# EasyEDA Pro project stiebel_eltron_bus_extension_pcb.eprj, board 1-PCB_PCB_stiebel_can_sniffer
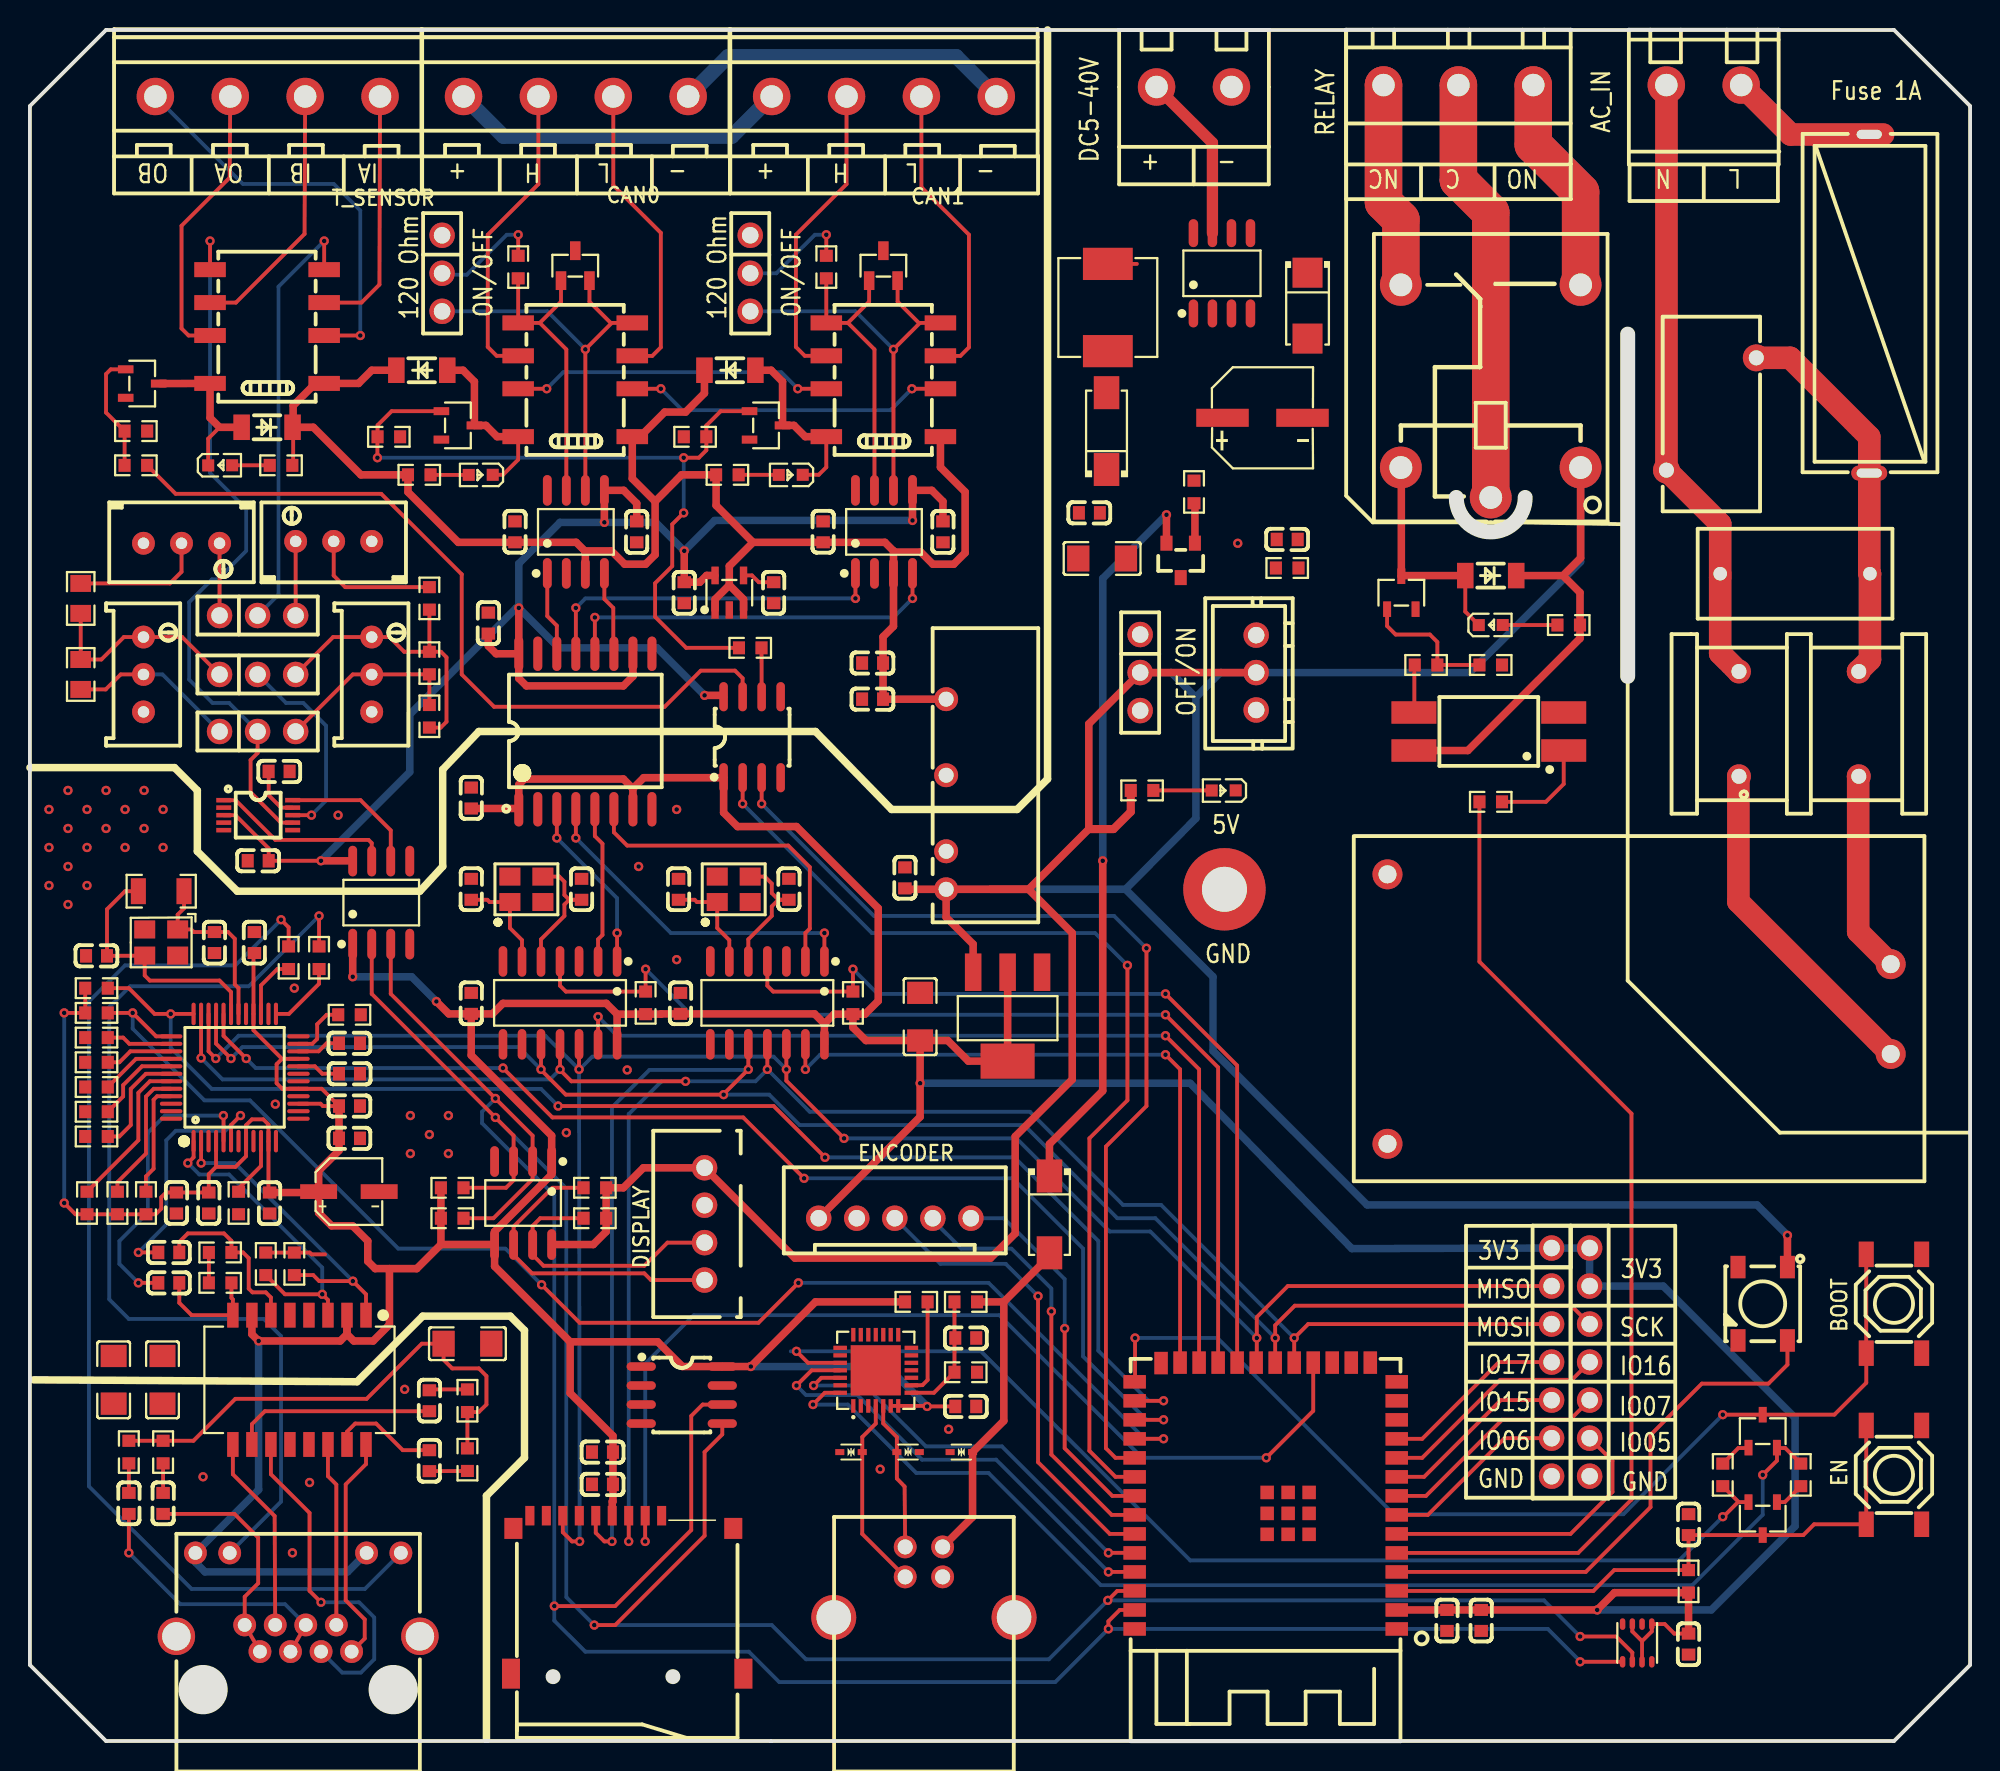
[diagram p1: board, top side]
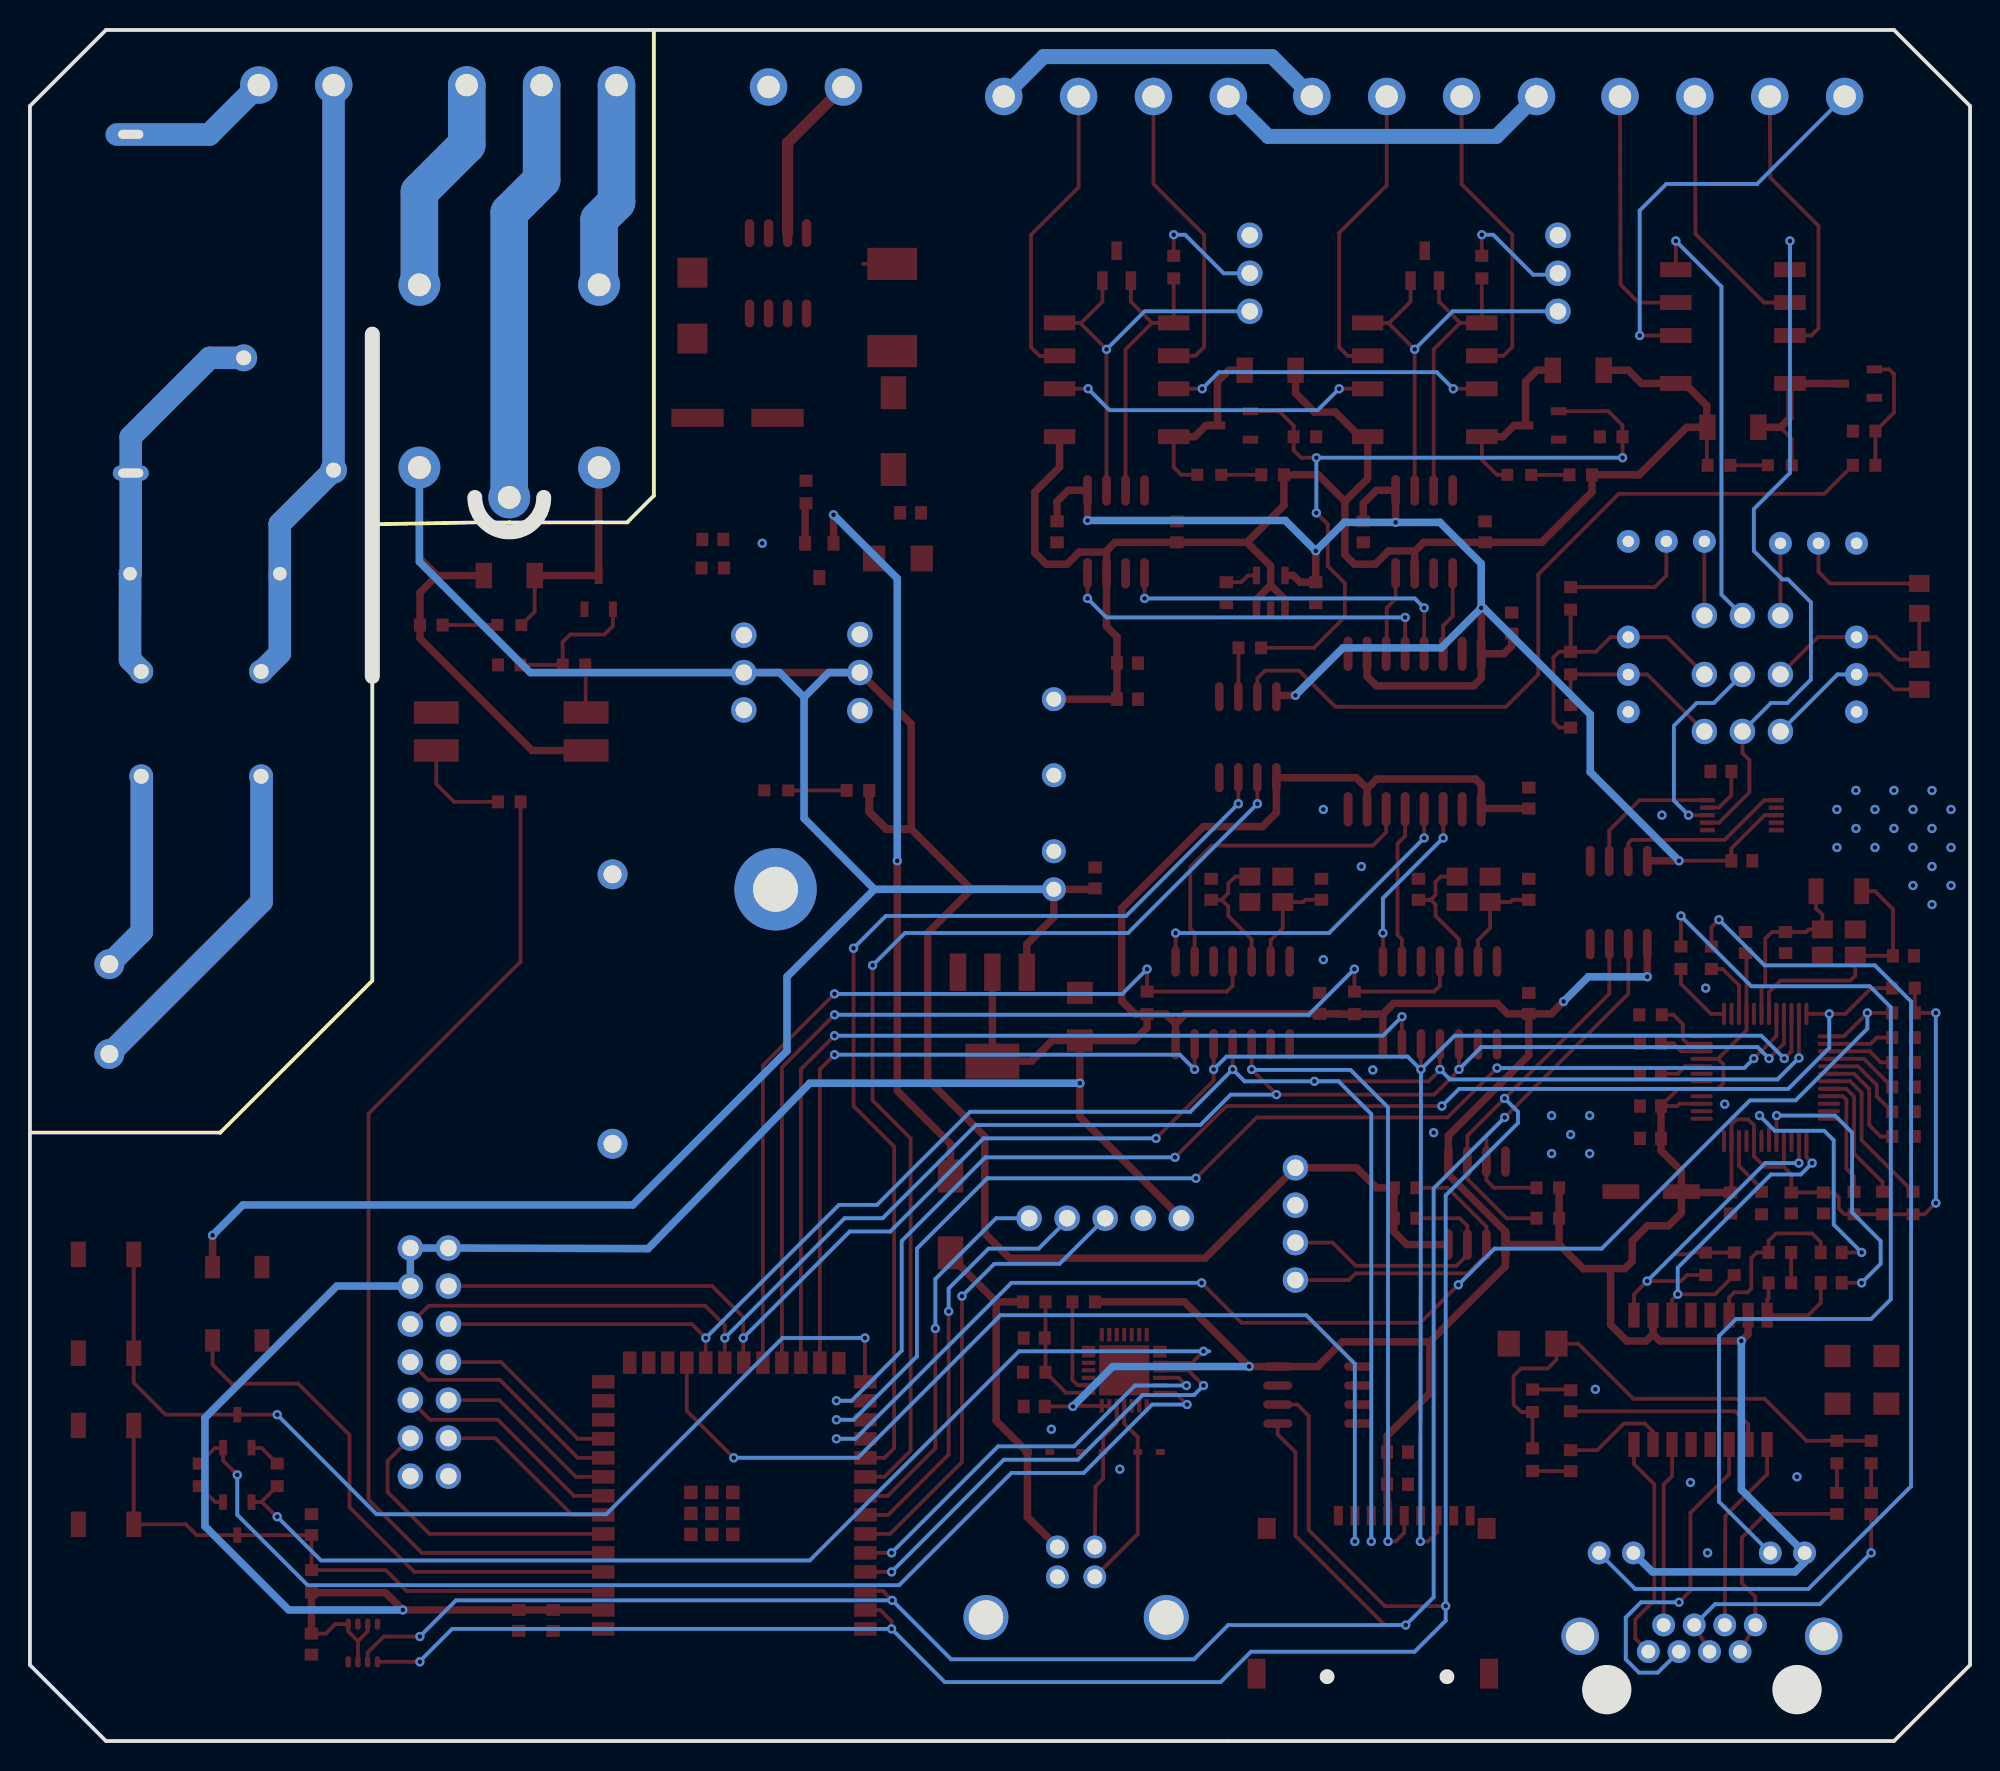
[diagram p2: board, bottom side, seen from below]

Outline 129.54 x 114.3 mm; copper layers: Top Layer, Bottom Layer. Coordinates in mm from the lower left corner of the outline.
Outline path: 99.84,83.07 arc(97.54,80.77) 95.24,83.07 ; 106.68,71.12 106.68,93.98 ; 0,109.22 0,5.08 5.08,0 124.46,0 129.54,5.08 129.54,109.22 124.46,114.3 5.08,114.3 0,109.22
Stack: Top Layer 0.035mm / Dielectric1 1.51mm FR4 er 4.5 / Bottom Layer 0.035mm

## Design rules (mm)
spacing Default (default): track to track 0.152, other pairs 0 to 0.152
track width Default (default): min 0.254, default 0.254, max 25.4
differential pair differentialPair (default): width min 0.127, default 0.254, max 2.54; gap min 0.152, default 0.152
via Default (default): diameter min 0.61, default 0.61, max 100.025; hole min 0.305, default 0.305, max 59.995
net SGND uses gge68040(1)
net HGND uses gge110343(1)
net GND uses gge148324(1)
net LM_5V_8 uses gge107073
net 5V_RAW uses gge107085
net C6_2 uses gge120455
pour e320 uses gge110343
pour e321 uses gge148324
pour e1328 uses gge107073
pour e1329 uses gge107085
pour e1330 uses gge110343(1)
pour e1331 uses gge68040(1)
pour e1332 uses gge120455
pour e1333 uses gge148324(1)

## Placement (name value [footprint] x y rotation side)
BOOT  TS-1187A-B-A-B  [SW-SMD_4P-L5.1-W5.1-P3.70-LS6.5-TL-2]  124.46 29.21 270 top
C1  22pF  [C0603]  29.46 56.9 270 top
C3  10uF  [C0603]  62.48 22.35 180 top
C4  10uF  [C0603]  96.9 8.06 90 top
C5  100nF  [C0603]  94.61 8.06 90 top
C6  22uF  [C1206]  71.59 78.99 0 top
C8  22uF  [C1206]  59.44 48.39 270 top
C9  6.8nF  [C0603]  9.27 32.64 180 top
C10  6.8nF  [C0603]  9.27 30.61 180 top
C11  1uF  [C0603]  62.48 26.92 180 top
C12  22pF  [C0603]  36.83 56.9 270 top
C14  100nF  [CAP-TH_L13.0-W6.0-P10.00-D1.2]  117.86 77.98 0 top
C15  10uF  [C0603]  38.23 19.3 180 top
C16  100nF  [C0603]  38.23 17.15 180 top
C17  1uF  [C0603]  110.74 14.46 270 top
C21  100nF  [C0603]  16 35.94 90 top
C22  10nF  [C0603]  14.99 53.34 90 top
C23  1uF  [C0603]  70.74 82.04 0 top
C24  10nF  [C0603]  21.34 46.61 0 top
C25  18pF  [C0603]  4.44 52.45 0 top
C26  10uF  [CAP-SMD_BD4.0-L4.3-W4.3-LS5.3-FD]  21.3 36.7 0 top
C27  100nF  [C0603]  83.95 80.26 0 top
C28  10nF  [C0603]  11.94 35.94 270 top
C30  4.7uF  [C0603]  21.34 44.58 180 top
C31  18pF  [C0603]  12.32 53.34 90 top
C32  100nF  [C0603]  29.46 62.99 270 top
C33  10nF  [C0603]  8.89 15.88 270 top
C34  10nF  [C0603]  6.6 15.88 270 top
C35  10nF  [C0603]  26.67 18.73 90 top
C36  10nF  [C0603]  26.67 22.73 270 top
C37  1nF  [C1206]  29.21 26.54 180 top
C38  4.7nF  [C1206]  5.59 24.13 90 top
C39  10nF  [C0603]  9.78 35.94 270 top
C40  10nF  [C0603]  21.34 42.42 0 top
C41  4.7nF  [C1206]  8.85 24.13 90 top
C42  10nF  [C0603]  21.34 40.26 0 top
C43  100nF  [C0603]  30.61 74.68 270 top
C44  100nF  [C0603]  43.69 76.71 90 top
C45  10uF  [C0603]  58.42 57.66 270 top
C46  10uF  [C0603]  56.26 72.01 0 top
C49  100nF  [C0603]  52.96 80.77 270 top
C50  100nF  [C0603]  60.96 80.77 90 top
C51  100nF  [C0603]  40.51 80.77 90 top
C52  100nF  [C0603]  32.39 80.77 270 top
C53  100nF  [C0603]  29.46 49.28 270 top
C54  22pF  [C0603]  43.31 56.9 270 top
C55  22pF  [C0603]  50.67 56.9 270 top
C56  100nF  [C0603]  43.43 49.28 270 top
C59  1uF  [C0603]  56.26 69.6 0 top
C60  22pF  [C0603]  49.66 76.71 90 top
C61  100nF  [C0603]  15.24 58.8 0 top
C62  100nF  [C0603]  16.64 64.77 180 top
C66  100nF  [C0603]  110.74 6.48 90 top
C76  220uF  [CAP-SMD_BD6.3-L6.6-W6.6-FD]  82.3 88.39 0 top
CAN0  DB127V-5.0-4P-GN-S  [CONN-TH_4P-P5.00_DB127V-5.0-4P-GN-S]  36.45 109.85 180 top
CAN1  DB127V-5.0-4P-GN-S  [CONN-TH_4P-P5.00_DB127V-5.0-4P-GN-S]  57.02 109.85 180 top
CARD  TF-01A  [TF-SMD_TF-01A]  39.88 9.78 0 top
D1  LL4148  [LL-34_L3.5-W1.5-RD]  97.54 77.85 180 top
D2  LESD5D5.0CT1G  [SOD-523_L1.2-W0.8-LS1.6-BI]  62.19 19.3 0 top
D3  LESD5D5.0CT1G  [SOD-523_L1.2-W0.8-LS1.6-BI]  58.63 19.3 180 top
D4  LESD5D5.0CT1G  [SOD-523_L1.2-W0.8-LS1.6-BI]  54.82 19.3 0 top
D5  SS14  [SMA_L4.2-W2.6-LS5.3-RD]  71.88 87.5 90 top
D6  SS14  [SMA_L4.2-W2.6-LS5.3-RD]  68.07 35.18 270 top
D7  LL4148  [LL-34_L3.5-W1.5-RD]  15.83 87.76 180 top
D8  LL4148  [LL-34_L3.5-W1.5-RD]  26.16 91.57 0 top
D9  LL4148  [LL-34_L3.5-W1.5-RD]  46.74 91.57 0 top
D10  SM24CANB-02HTG  [SOT-23-3_L2.9-W1.3-P1.90-LS2.4-BR]  36.41 98.55 270 top
D11  SM24CANB-02HTG  [SOT-23-3_L2.9-W1.3-P1.90-LS2.4-BR]  56.98 98.55 270 top
D14  SS34  [SMA_L4.3-W2.6-LS5.2-RD]  85.3 95.89 270 top
DISPLAY  B4B-XH-A(LF)(SN)  [CONN-TH_B4B-XH-A-LF-SN]  45.04 34.54 90 top
EN  TS-1187A-B-A-B  [SW-SMD_4P-L5.1-W5.1-P3.70-LS6.5-TL-2]  124.46 17.78 270 top
ENCODER  B5B-XH-A (LF)(SN)  [CONN-TH_B5B-XH-A-LF-SN]  57.74 34.92 0 top
F1  5x20 BLX-Atype Fuse holder XC-7  [FUSE-TH_L22.6-W9.0]  122.81 96.01 270 top
H1  PZ254V-11-03P  [HDR-TH_3P-P2.54-V-M]  27.52 98.04 270 top
H2  PZ254V-11-03P  [HDR-TH_3P-P2.54-V-M]  48.09 98.04 270 top
H3  PZ254V-11-03P  [HDR-TH_3P-P2.54-V-M]  15.2 71.25 0 top
H4  PZ254V-11-03P  [HDR-TH_3P-P2.54-V-M]  15.2 67.44 0 top
H5  PZ254V-11-03P  [HDR-TH_3P-P2.54-V-M]  15.2 75.18 0 top
H6  PZ254V-11-03P  [HDR-TH_3P-P2.54-V-M]  74.13 71.37 270 top
H8  PZ254V-12-14P  [HDR-TH_14P-P2.54-V-M-R2-C7-S2.54]  102.87 25.31 270 top
L3  15mH  [FILTER-TH_4P-L17.0-W12.0-P7.00-D0.6-S8.00]  118.11 67.94 270 top
L6  68uH  [IND-SMD_L7.1-W6.6]  71.97 95.76 90 top
LED1  KT-0603R  [LED0603-RD]  97.54 74.55 0 top
LED2  WS2812B-B/W  [LED-SMD_4P-L5.0-W5.0-TL_WS2812B-B]  115.7 29.21 270 top
LED3  KT-0603R  [LED0603-RD]  79.71 63.5 180 top
LED4  KT-0603R  [LED0603-RD]  12.7 85.22 0 top
LED5  KT-0603R  [LED0603-RD]  30.1 84.58 180 top
LED6  KT-0603R  [LED0603-RD]  50.8 84.58 180 top
LM_5V  LM2594M-5.0  [SOP-8_L4.9-W3.9-P1.27-LS6.0-BL]  79.59 98.04 0 top
NOREF  -  [Pad_e3671]  79.76 56.9 0 top
P2  WJ126V-5.0-2P  [CONN-TH_WJ126V-5.0-2P]  77.72 110.49 270 top
PW1  B0505S-2WR2  [PWRM-TH_B0505S-2WR2_C2992385]  61.17 63.25 90 top
Q1  AO3401A  [SOT-23_L2.9-W1.3-P1.90-LS2.4-BR]  76.83 78.87 90 top
Q2  S8050  [SOT-23-3_L3.0-W1.7-P0.95-LS2.9-BR]  91.57 76.71 270 top
Q3  S8050  [SOT-23-3_L3.0-W1.7-P0.95-LS2.9-BR]  28.58 87.88 180 top
Q4  S8050  [SOT-23-3_L3.0-W1.7-P0.95-LS2.9-BR]  49.15 87.88 180 top
Q6  S8050  [SOT-23-3_L3.0-W1.7-P0.95-LS2.9-BR]  7.49 90.68 180 top
Q7  S8050  [SOT-23-3_L3.0-W1.7-P0.95-LS2.9-BR]  115.7 14.86 90 top
Q8  S8050  [SOT-23-3_L3.0-W1.7-P0.95-LS2.9-BR]  115.7 20.7 270 top
R1  47.5kΩ  [R0603]  62.48 24.64 180 top
R2  10kΩ  [R0603]  28.19 34.92 180 top
R3  22.1kΩ  [R0603]  62.48 29.34 180 top
R4  10kΩ  [R0603]  110.74 10.67 90 top
R5  10kΩ  [R0603]  26.67 68.45 270 top
R6  10kΩ  [R0603]  26.67 72.01 90 top
R7  10kΩ  [R0603]  4.44 48.64 0 top
R8  75Ω  [R0603]  12.7 30.61 0 top
R9  75Ω  [R0603]  12.7 32.64 0 top
R10  75Ω  [R0603]  15.75 31.88 270 top
R11  75Ω  [R0603]  17.65 31.88 270 top
R12  75Ω  [R0603]  6.6 19.3 270 top
R13  4.7kΩ  [R0603]  93.22 71.88 0 top
R14  10kΩ  [R0603]  97.54 71.88 180 top
R15  75Ω  [R0603]  29.21 18.8 270 top
R16  75Ω  [R0603]  29.21 22.73 90 top
R17  330Ω  [R0603]  19.3 52.32 270 top
R19  10kΩ  [R0603]  28.19 36.96 180 top
R20  10kΩ  [R0603]  37.72 36.96 0 top
R21  10kΩ  [R0603]  37.72 34.92 0 top
R22  10kΩ  [R0603]  118.24 17.78 90 top
R23  1mΩ  [RES-SMD_L3.2-W1.6_PA1206]  8.76 56.77 0 top
R24  12.4kΩ  [R0603]  13.93 35.94 90 top
R25  10kΩ  [R0603]  21.34 48.51 180 top
R26  10kΩ  [R0603]  4.44 50.29 0 top
R27  10kΩ  [R0603]  7.75 35.94 90 top
R28  10kΩ  [R0603]  5.84 35.94 90 top
R29  10kΩ  [R0603]  113.03 17.78 270 top
R32  1kΩ  [R0603]  59.18 29.34 180 top
R33  75Ω  [R0603]  8.89 19.3 270 top
R34  120Ω  [R0603]  32.6 98.46 90 top
R35  120Ω  [R0603]  53.17 98.46 90 top
R36  10kΩ  [R0603]  41.11 49.31 270 top
R37  10kΩ  [R0603]  54.95 49.31 270 top
R38  100Ω  [RES-ADJ-TH_3296W]  10.12 80.01 270 top
R39  500Ω  [R0805]  3.39 71.25 90 top
R40  330Ω  [R0603]  17.27 52.32 270 top
R41  10kΩ  [R0603]  3.81 35.94 90 top
R42  10kΩ  [R0603]  4.44 40.39 0 top
R43  10kΩ  [R0603]  7.07 87.5 180 top
R44  4.7kΩ  [R0603]  7.07 85.22 180 top
R45  1kΩ  [RES-ADJ-TH_3P-L10.0-W10.0-P2.50-BL-BS]  7.58 71.25 0 top
R46  1.4kΩ  [R0603]  26.67 76.33 270 top
R47  100Ω  [RES-ADJ-TH_3296W]  20.28 80.14 90 top
R48  10kΩ  [R0603]  4.44 42.04 0 top
R49  2kΩ  [RES-ADJ-TH_3P-L10.0-W10.0-P2.50-BL-BS]  22.82 71.25 0 top
R50  10kΩ  [R0603]  4.44 43.69 0 top
R51  10kΩ  [R0603]  44.41 87.12 0 top
R52  10kΩ  [R0603]  23.96 87.12 180 top
R53  4.7kΩ  [R0603]  48.09 73.03 180 top
R54  10D561K  [RES-TH_L13.0-W6.0-P7.50-D0.9-S6.00]  112.27 88.65 90 top
R55  100kΩ  [R0603]  77.72 83.44 270 top
R56  100kΩ  [R0603]  83.95 78.36 0 top
R57  10kΩ  [R0603]  4.44 45.34 0 top
R58  10kΩ  [R0603]  4.44 46.99 0 top
R59  470Ω  [R0603]  97.54 62.74 0 top
RELAY_CAN0  G6K-2F-Y-DC5  [RELAY-SMD_G6K-2F-X-XX]  36.41 90.93 90 top
RELAY_CAN1  G6K-2F-Y-DC5  [RELAY-SMD_G6K-2F-X-XX]  56.98 90.93 90 top
RELAY_T  G6K-2F-Y-DC5  [RELAY-SMD_G6K-2F-X-XX]  15.83 94.49 90 top
RJ1  R-RJ45R08P-C000  [RJ45-TH_R-RJ45R08P-C000]  17.91 9.27 0 top
RL1  1kΩ  [R0603]  46.57 84.58 0 top
RL2  1kΩ  [R0603]  26 84.58 0 top
RL3  1kΩ  [R0603]  16.76 85.22 180 top
RL4  1kΩ  [R0603]  74.26 63.5 0 top
RL10  1kΩ  [R0603]  102.74 74.55 0 top
RLY1  SRD-05VDC-SL-C  [RELAY-TH_SRD-XXVDC-XL-C]  97.54 90.17 90 top
T1  H1102NLT  [XFMR-SMD_H1102NLT]  17.99 24.13 180 top
T_SENSOR  DB127V-5.0-4P-GN-S  [CONN-TH_4P-P5.00_DB127V-5.0-4P-GN-S]  15.88 109.85 180 top
U1  MCP2562FDT-E/SN  [SOIC-8_L4.9-W3.9-P1.27-LS6.0-BL]  36.45 80.77 0 top
U2  XY300V-A-5.0-2P  [CONN-TH_XY300V-A-5.0-2P]  111.76 110.62 0 top
U3  ADUM1402CRWZ-RL  [SOIC-16_L10.3-W7.5-P1.27-LS10.3-TL]  37.08 67.44 90 top
U4  MCP2562FDT-E/SN  [SOIC-8_L4.9-W3.9-P1.27-LS6.0-BL]  57.02 80.77 0 top
U5  XY300V-A-5.0-3P  [CONN-TH_XY300V-A-5.0-3P]  95.38 110.62 0 top
U6  TCA9517DR  [SOIC-8_L4.9-W3.9-P1.27-LS6.0-BL]  32.93 35.94 180 top
U7  W5500  [LQFP-48_L7.0-W7.0-P0.50-LS9.0-BL]  13.68 44.32 0 top
U8  EL817S1(C)(TU)-F  [OPTO-SMD-4_L4.6-W6.5-P2.54-LS10.3-TL]  97.41 67.44 180 top
U9  AMS1117-3.3  [SOT-223-3_L6.5-W3.4-P2.30-LS7.0-BR]  65.28 48.39 90 top
U11  MCP2518FDT-E/SL  [SOIC-14_L8.7-W3.9-P1.27-LS6.0-BL]  35.39 49.31 180 top
U12  MCP2518FDT-E/SL  [SOIC-14_L8.7-W3.9-P1.27-LS6.0-BL]  49.24 49.31 180 top
U13  ESP32-S3-WROOM-1(N16)  [WIRELM-SMD_ESP32-S3-WROOM-1]  82.51 16.38 180 top
U14  ISO1540DR  [SOIC-8_L4.9-W3.9-P1.27-LS6.0-BL]  23.45 56.01 0 top
U15  RT9193-33GB  [SOT-23-5_L3.0-W1.7-P0.95-LS2.8-BL]  46.7 76.71 0 top
U16  HLK-5M05  [PWRM-TH_HLK-5M05]  107.44 48.89 180 top
U17  900Ω  [R0805]  3.39 76.33 90 top
U18  ADuM1200ARZ-RL7  [SOIC-8_L5.0-W4.0-P1.27-LS6.0-BL]  48.22 67.06 0 top
U21  BME280  [LGA-8_BME280_BL]  107.32 6.55 90 top
U22  B3B-XH-A(LF)(SN)  [CONN-TH_3P-P2.50_A2501WV2-3P]  81.88 71.37 270 top
U24  AT24C32D-SSHM-T  [SOIC-8_L5.0-W4.0-P1.27-LS6.0-BL]  43.52 23.11 270 top
U25  DS3502U+T&amp;R  [UMAX-10_L3.0-W3.0-P0.50-LS4.9-BL]  15.24 61.85 270 top
UAT_TO_USB  CP2102N-A02-GQFN28R  [QFN-28_L5.0-W5.0-P0.50-TL-EP3.3]  56.48 24.76 90 top
USB  670688000  [USB-B-TH_67068-8000]  59.69 10.61 0 top
X2  40MHz  [OSC-SMD_4P-L3.2-W2.5-BL_SIT8008BI]  33.15 56.9 0 top
X3  40MHz  [OSC-SMD_4P-L3.2-W2.5-BL_SIT8008BI]  46.99 56.9 0 top
X4  25MHz  [OSC-SMD_4P-L3.2-W2.5-BL]  8.76 53.34 180 top

## Footprints (pads in the part's own frame, mm; a bottom-side part is the same pattern mirrored in y, then rotated)
C0603
  rect 0.8x0.9 smd: 1(-0.7,0) 2(0.7,0)
C1206
  rect 1.485x1.728 smd: 1(-1.593,0) 2(1.593,0)
CAP-SMD_BD4.0-L4.3-W4.3-LS5.3-FD
  rect 2.46x0.98 smd: 1(-2.02,0) 2(2.02,0)
CAP-SMD_BD6.3-L6.6-W6.6-FD
  rect 3.5x1.2 smd: 1(-2.67,0) 2(2.67,0)
CAP-TH_L13.0-W6.0-P10.00-D1.2
  round 1.5 hole 0.9: 1(-5,0) 2(5,0)
CONN-TH_3P-P2.50_A2501WV2-3P
  round 1.7 hole 1.1: 1(-2.5,0) 2(0.001,0) 3(2.5,0)
CONN-TH_4P-P5.00_DB127V-5.0-4P-GN-S
  round 2.5 hole 1.5: 1(-7.5,0) 2(-2.5,0) 3(2.5,0) 4(7.5,0)
CONN-TH_B4B-XH-A-LF-SN
  round 1.7 hole 1.1: 1(3.75,0) 2(1.25,0) 3(-1.25,0) 4(-3.75,0)
CONN-TH_B5B-XH-A-LF-SN
  round 1.7 hole 1.1: 1(5.08,0) 2(2.54,0) 3(0,0) 4(-2.54,0) 5(-5.08,0)
CONN-TH_WJ126V-5.0-2P
  round 2.5 hole 1.5: 1(0,2.501) 2(0,-2.501)
CONN-TH_XY300V-A-5.0-2P
  round 2.5 hole 1.5: 1(-2.5,0) 2(2.5,0)
CONN-TH_XY300V-A-5.0-3P
  round 2.5 hole 1.5: 1(-5,0) 2(0,0) 3(5,0)
FILTER-TH_4P-L17.0-W12.0-P7.00-D0.6-S8.00
  round 1.6 hole 1: 1(3.5,-4) 2(-3.5,-4) 3(-3.5,4) 4(3.5,4)
FUSE-TH_L22.6-W9.0
  oval 1x2.4 hole 0.6x1.68: 1(-11.313,0) 2(11.313,0)
HDR-TH_3P-P2.54-V-M
  round 1.7 hole 1.1: 1(-2.54,0) 2(0,0) 3(2.54,0)
HDR-TH_14P-P2.54-V-M-R2-C7-S2.54
  round 1.7 hole 1.1: 1(-7.62,-1.27) 2(-7.62,1.27) 3(-5.08,-1.27) 4(-5.08,1.27) 5(-2.54,-1.27) 6(-2.54,1.27) 7(0,-1.27) 8(0,1.27) 9(2.54,-1.27) 10(2.54,1.27) 11(5.08,-1.27) 12(5.08,1.27) 13(7.62,-1.27) 14(7.62,1.27)
IND-SMD_L7.1-W6.6
  rect 2.15x3.32 smd: 1(-2.913,0) 2(2.913,0)
LED0603-RD
  rect 0.8x0.8 smd: 1(-0.799,-0.004) 2(0.799,0.004)
LED-SMD_4P-L5.0-W5.0-TL_WS2812B-B
  rect 1.5x1 smd: 1(-2.45,1.65) 2(-2.45,-1.65) 3(2.45,-1.65) 4(2.45,1.65)
LGA-8_BME280_BL
  oval 0.767x0.364 smd: 1(-1.258,-0.975) 2(-1.258,-0.325) 3(-1.258,0.325) 4(-1.258,0.975) 5(1.258,0.975) 6(1.258,0.325) 7(1.258,-0.325) 8(1.258,-0.975)
LL-34_L3.5-W1.5-RD
  rect 1.1x1.7 smd: 1(-1.7,0) 2(1.7,0)
LQFP-48_L7.0-W7.0-P0.50-LS9.0-BL
  oval 0.27x1.5 smd: 1(-2.75,-4.25) 2(-2.25,-4.25) 3(-1.75,-4.25) 4(-1.25,-4.25) 5(-0.75,-4.25) 6(-0.25,-4.25) 7(0.25,-4.25) 8(0.75,-4.25) 9(1.25,-4.25) 10(1.75,-4.25) 11(2.25,-4.25) 12(2.75,-4.25) 25(2.75,4.25) 26(2.25,4.25) 27(1.75,4.25) 28(1.25,4.25) 29(0.75,4.25) 30(0.25,4.25) 31(-0.25,4.25) 32(-0.75,4.25) 33(-1.25,4.25) 34(-1.75,4.25) 35(-2.25,4.25) 36(-2.75,4.25)
  oval 1.5x0.27 smd: 13(4.25,-2.75) 14(4.25,-2.25) 15(4.25,-1.75) 16(4.25,-1.25) 17(4.25,-0.75) 18(4.25,-0.25) 19(4.25,0.25) 20(4.25,0.75) 21(4.25,1.25) 22(4.25,1.75) 23(4.25,2.25) 24(4.25,2.75) 37(-4.25,2.75) 38(-4.25,2.25) 39(-4.25,1.75) 40(-4.25,1.25) 41(-4.25,0.75) 42(-4.25,0.25) 43(-4.25,-0.25) 44(-4.25,-0.75) 45(-4.25,-1.25) 46(-4.25,-1.75) 47(-4.25,-2.25) 48(-4.25,-2.75)
OPTO-SMD-4_L4.6-W6.5-P2.54-LS10.3-TL
  rect 3x1.5 smd: 1(-5,1.27) 2(-5,-1.27) 3(5,-1.27) 4(5,1.27)
OSC-SMD_4P-L3.2-W2.5-BL
  rect 1.4x1.2 smd: 1(-1.1,-0.875) 2(1.1,-0.875) 3(1.1,0.875) 4(-1.1,0.875)
OSC-SMD_4P-L3.2-W2.5-BL_SIT8008BI
  rect 1.4x1.2 smd: 1(-1.1,-0.85) 2(1.1,-0.85) 3(1.1,0.85) 4(-1.1,0.85)
Pad_e3671
  round 5.5 hole 3: 1(0,0)
PWRM-TH_B0505S-2WR2_C2992385
  round 1.6 hole 1: 1(-6.35,0) 2(-3.81,0) 4(1.27,0) 6(6.35,0)
PWRM-TH_HLK-5M05
  round 2 hole 1.2: 1(-16.8,3) 2(-16.8,-3) 3(16.8,9) 4(16.8,-9)
QFN-28_L5.0-W5.0-P0.50-TL-EP3.3
  rect 0.905x0.28 smd: 1(-2.377,1.5) 2(-2.377,1) 3(-2.377,0.5) 4(-2.377,0) 5(-2.377,-0.5) 6(-2.377,-1) 7(-2.377,-1.5) 15(2.377,-1.5) 16(2.377,-1) 17(2.377,-0.5) 18(2.377,0) 19(2.377,0.5) 20(2.377,1) 21(2.377,1.5)
  rect 0.28x0.905 smd: 8(-1.5,-2.377) 9(-1,-2.377) 10(-0.5,-2.377) 11(0,-2.377) 12(0.5,-2.377) 13(1,-2.377) 14(1.5,-2.377) 22(1.5,2.377) 23(1,2.377) 24(0.5,2.377) 25(0,2.377) 26(-0.5,2.377) 27(-1,2.377) 28(-1.5,2.377)
  rect 3.35x3.35 smd: 29(0,0)
R0603
  rect 0.806x0.864 smd: 1(-0.753,0) 2(0.753,0)
R0805
  rect 1.133x1.377 smd: 1(-1,0) 2(1,0)
RELAY-SMD_G6K-2F-X-XX
  rect 1x2.1 smd: 1(-3.8,-3.81) 2(-0.6,-3.81) 3(1.6,-3.81) 4(3.8,-3.81) 5(3.8,3.81) 6(1.6,3.81) 7(-0.6,3.81) 8(-3.8,3.81)
RELAY-TH_SRD-XXVDC-XL-C
  round 2.794 hole 1.524: 1(-5.1,-6) 2(7.1,-6) 3(7.1,6) 4(-5.1,6) 5(-7.1,0)
RES-ADJ-TH_3P-L10.0-W10.0-P2.50-BL-BS
  round 1.524 hole 0.762: 1(0,2.5) 2(0,-0.001) 3(0,-2.5)
RES-ADJ-TH_3296W
  round 1.524 hole 0.762: 1(0,2.54) 2(0,0) 3(0,-2.54)
RES-SMD_L3.2-W1.6_PA1206
  rect 1x1.728 smd: 1(-1.524,0) 2(1.524,0)
RES-TH_L13.0-W6.0-P7.50-D0.9-S6.00
  round 1.8 hole 1: 1(-3.75,3) 2(3.75,-3)
RJ45-TH_R-RJ45R08P-C000
  round 1.524 hole 0.914: 1(3.57,-3.295) 2(2.55,-1.515) 3(1.53,-3.295) 4(0.51,-1.515) 5(-0.51,-3.295) 6(-1.53,-1.515) 7(-2.55,-3.295) 8(-3.57,-1.515) 9(-6.86,3.295) 10(-4.57,3.295) 11(4.57,3.295) 12(6.86,3.295)
  round 2.5 hole 1.9: 13(8.13,-2.275) 14(-8.13,-2.275)
SMA_L4.2-W2.6-LS5.3-RD
  rect 2.2x1.7 smd: 1(-2.566,0) 2(2.566,0)
SMA_L4.3-W2.6-LS5.2-RD
  rect 2x2 smd: 1(-2.2,0) 2(2.2,0)
SOD-523_L1.2-W0.8-LS1.6-BI
  rect 0.6x0.4 smd: 1(-0.75,0) 2(0.75,0)
SOIC-8_L4.9-W3.9-P1.27-LS6.0-BL
  oval 0.588x2.045 smd: 1(-1.905,-2.772) 2(-0.635,-2.772) 3(0.635,-2.772) 4(1.905,-2.772) 5(1.905,2.772) 6(0.635,2.772) 7(-0.635,2.772) 8(-1.905,2.772)
SOIC-8_L5.0-W4.0-P1.27-LS6.0-BL
  oval 0.569x1.95 smd: 1(-1.905,-2.705) 2(-0.635,-2.705) 3(0.635,-2.705) 4(1.905,-2.705) 5(1.905,2.705) 6(0.635,2.705) 7(-0.635,2.705) 8(-1.905,2.705)
SOIC-14_L8.7-W3.9-P1.27-LS6.0-BL
  oval 0.574x2.038 smd: 1(-3.81,-2.769) 2(-2.54,-2.769) 3(-1.27,-2.769) 4(0,-2.769) 5(1.27,-2.769) 6(2.54,-2.769) 7(3.81,-2.769) 8(3.81,2.769) 9(2.54,2.769) 10(1.27,2.769) 11(0,2.769) 12(-1.27,2.769) 13(-2.54,2.769) 14(-3.81,2.769)
SOIC-16_L10.3-W7.5-P1.27-LS10.3-TL
  oval 2.3x0.6 smd: 1(-5.194,4.445) 2(-5.194,3.175) 3(-5.194,1.905) 4(-5.194,0.635) 5(-5.194,-0.635) 6(-5.194,-1.905) 7(-5.194,-3.175) 8(-5.194,-4.445) 9(5.194,-4.445) 10(5.194,-3.175) 11(5.194,-1.905) 12(5.194,-0.635) 13(5.194,0.635) 14(5.194,1.905) 15(5.194,3.175) 16(5.194,4.445)
SOP-8_L4.9-W3.9-P1.27-LS6.0-BL
  oval 0.63x1.865 smd: 1(-1.905,-2.683) 2(-0.635,-2.683) 3(0.635,-2.683) 4(1.905,-2.683) 5(1.905,2.683) 6(0.635,2.683) 7(-0.635,2.683) 8(-1.905,2.683)
SOT-23-3_L2.9-W1.3-P1.90-LS2.4-BR
  rect 1.25x0.7 smd: 1(1,-0.95) 2(1,0.95) 3(-1,0)
SOT-23-3_L3.0-W1.7-P0.95-LS2.9-BR
  rect 1.038x0.532 smd: 1(1.101,-0.95) 2(1.101,0.95) 3(-1.101,0)
SOT-23-5_L3.0-W1.7-P0.95-LS2.8-BL
  rect 0.49x1.157 smd: 1(-0.95,-1.153) 2(0,-1.153) 3(0.95,-1.153)
  rect 0.49x1.175 smd: 4(0.95,1.153) 5(-0.95,1.153)
SOT-23_L2.9-W1.3-P1.90-LS2.4-BR
  rect 1x0.8 smd: 1(1.15,-0.95) 2(1.15,0.95) 3(-1.15,0)
SOT-223-3_L6.5-W3.4-P2.30-LS7.0-BR
  rect 2.5x1.1 smd: 1(2.97,-2.3) 2(2.97,0) 3(2.97,2.3)
  rect 2.34x3.6 smd: 4(-2.97,0)
SW-SMD_4P-L5.1-W5.1-P3.70-LS6.5-TL-2
  rect 1.7x1 smd: 1(-3.3,1.85) 2(3.3,1.85) 3(-3.3,-1.85) 4(3.3,-1.85)
TF-SMD_TF-01A
  rect 0.6x1.3 smd: 1(2.3,5.276) 2(1.2,5.276) 3(0.101,5.276) 4(-0.999,5.276) 5(-2.099,5.276) 6(-3.2,5.276) 7(-4.3,5.276) 8(-5.399,5.276) 9(-6.5,5.276)
  rect 1.2x1.4 smd: 10(-7.599,4.426) 13(7.081,4.426)
  rect 1.2x2 smd: 11(-7.76,-5.276) 12(7.76,-5.276)
UMAX-10_L3.0-W3.0-P0.50-LS4.9-BL
  rect 0.3x1 smd: 1(-0.999,-2.3) 2(-0.499,-2.3) 3(0.001,-2.3) 4(0.501,-2.3) 5(1.001,-2.3) 6(0.999,2.3) 7(0.499,2.3) 8(-0.001,2.3) 9(-0.5,2.3) 10(-1.001,2.3)
USB-B-TH_67068-8000
  round 1.524 hole 1: 1(1.25,2.354) 2(-1.25,2.354) 3(-1.25,0.354) 4(1.25,0.354)
  round 3 hole 2.3: 5(6.02,-2.355) 6(-6.02,-2.355)
WIRELM-SMD_ESP32-S3-WROOM-1
  rect 1.5x0.9 smd: 1(-8.75,8.895) 2(-8.75,7.625) 3(-8.75,6.355) 4(-8.75,5.085) 5(-8.75,3.815) 6(-8.75,2.545) 7(-8.75,1.275) 8(-8.75,0.005) 9(-8.75,-1.265) 10(-8.75,-2.535) 11(-8.75,-3.805) 12(-8.75,-5.075) 13(-8.75,-6.345) 14(-8.75,-7.615) 27(8.75,-7.615) 28(8.75,-6.345) 29(8.75,-5.075) 30(8.75,-3.805) 31(8.75,-2.535) 32(8.75,-1.265) 33(8.75,0.005) 34(8.75,1.275) 35(8.75,2.545) 36(8.75,3.815) 37(8.75,5.085) 38(8.75,6.355) 39(8.75,7.625) 40(8.75,8.895)
  rect 0.9x1.5 smd: 15(-6.985,-8.895) 16(-5.715,-8.895) 17(-4.445,-8.895) 18(-3.175,-8.895) 19(-1.905,-8.895) 20(-0.635,-8.895) 21(0.635,-8.895) 22(1.905,-8.895) 23(3.175,-8.895) 24(4.445,-8.895) 25(5.715,-8.895) 26(6.985,-8.865)
  rect 0.9x0.9 smd: 41(-0.1,-0.225) 42(-1.5,-0.226) 43(-2.9,-0.225) 44(-2.9,2.575) 45(-1.5,2.575) 46(-0.1,2.575) 47(-0.1,1.175) 48(-2.9,1.175) 49(-1.5,1.175)
XFMR-SMD_H1102NLT
  rect 0.76x1.66 smd: 1(-4.445,-4.318) 2(-3.175,-4.318) 3(-1.905,-4.318) 4(-0.635,-4.318) 5(0.635,-4.318) 6(1.905,-4.318) 7(3.175,-4.318) 8(4.445,-4.318) 9(4.445,4.318) 10(3.175,4.318) 11(1.905,4.318) 12(0.635,4.318) 13(-0.635,4.318) 14(-1.905,4.318) 15(-3.175,4.318) 16(-4.445,4.318)

## Nets
As in the schematic, except:
GND: BOOT.1 BOOT.2 C1.1 C3.1 C4.1 C5.1 C6.1 C8.1 C11.1 C12.1 C15.2 C16.2 C17.1 C21.1 C22.2 C23.1 C24.2 C25.1 C26.2 C27.1 C28.2 C30.1 C31.1 C32.1 C38.2 C39.2 C40.2 C41.2 C42.2 C45.1 C53.1 C54.1 C55.1 C56.1 C66.1 C76.2 CARD.6 CARD.10 CARD.11 CARD.12 CARD.13 D2.1 D3.1 D4.1 D14.2 DISPLAY.2 EN.1 EN.2 ENCODER.4 H6.3 H8.13 H8.14 LED2.3 LED3.1 LM_5V.5 LM_5V.6 NOREF.1 P2.1 PW1.2 Q2.2 R1.1 R14.1 R24.1 R25.1 R42.1 R48.1 R50.1 R56.1 R57.1 R58.1 U3.2 U3.8 U6.4 U7.3 U7.9 U7.14 U7.16 U7.19 U7.29 U7.48 U8.2 U9.1 U11.7 U12.7 U13.1 U13.40 U13.41 U13.42 U13.43 U13.44 U13.45 U13.46 U13.47 U13.48 U13.49 U14.4 U16.3 U18.4 U21.1 U21.5 U21.7 U22.3 U24.1 U24.2 U24.3 U24.4 U24.7 UAT_TO_USB.3 UAT_TO_USB.29 USB.4 USB.5 USB.6 X2.2 X2.4 X3.2 X3.4 X4.2 X4.4
R8_1: R8.1 R9.1
R10_1: R10.1 R11.1

Pads without a net: CARD 1 8 9; H1 1; H2 1; LED2 2; LM_5V 1 2 3; R38 3; R45 3; R47 3; R49 3; T1 4 5 12 13; U7 7 12 13 18 24 26 46 47; U11 3 8 9; U12 3 8 9; U13 12 13 14 15 16 17 26; U25 6; UAT_TO_USB 1 2 10 11 12 13 14 15 16 17 18 19 20 21 22 23 27

## Via types
v1: diameter 0.62, hole 0.31, Top Layer to Bottom Layer, 155 vias
v2: diameter 0.61, hole 0.305, Top Layer to Bottom Layer, 1 via

## Routing (per net, layer and track width the routed paths; a pad name or vN(x,y) marks a point on that pad's centre or on a via; arc(x,y) is an arc through that point)
3V3: length 458.1
  Top Layer w0.254: U7.4 12.43,38.35 ; 12.43,38.35 13.72,38.35 14.43,39.06 U7.8 ; 12.43,38.35 11.94,37.87 C28.1 C39.1 ; 107.64,6.68 U21.2 ; 107.64,6.68 106.99,7.32 U21.6 ; 107.64,6.68 108.29,7.32 U21.8 109.15,7.81 109.79,7.18 110.74,7.18 ; v1(2.29,35.94) 3.04,35.19 R41.1 R28.1 R27.1 ; v1(2.29,48.64) R7.1 R26.1 ; 17.92,43.57 19.48,43.57 C40.1 19.56,42.42 19.4,42.57 17.92,42.57 ; C21.2 15.93,36.64 15.93,41.18 15.58,41.53 14.82,41.53 14.43,41.14 14.43,40.07 ; 16.83,45.57 16.47,45.21 16.47,43.94 16.84,43.57 17.93,43.57 ; 16.83,45.57 14.93,47.48 U7.28 14.93,52.58 C22.1 ; 16.83,45.57 U7.21 ; 7.75,35.19 8.39,35.19 8.76,35.56 8.76,36.32 9.08,36.64 9.78,36.64 ; UAT_TO_USB.6 UAT_TO_USB.7 59.87,22.39 v1(59.9,22.35) C3.2
  Top Layer w0.5: ENCODER.5 59.44,41.7 v1(59.44,43.94) C8.2 ; C8.2 61.28,46.79 62.66,45.42 65.28,45.42 ; C8.2 55.82,46.79 54.95,47.67 R37.2 53.69,48.56 53.05,47.91 ; 24,31.56 23.05,31.56 22.55,32.06 22.55,33.4 21.54,34.42 20.14,34.42 19.28,35.28 C26.1 ; 53.05,47.91 U12.14 ; 53.05,47.91 52.38,48.58 C56.2 42.15,48.58 42.13,48.56 41.11,48.56 39.2,48.55 ; C26.1 19.28,38.09 20.64,39.45 C42.1 ; C26.1 19.21,36.64 C21.2 ; 21.17,27.18 T1.2 21.17,27.18 ; 21.17,27.18 20.72,26.73 v1(15.27,26.73) 14.82,27.18 14.82,28.45 ; 21.17,27.18 21.62,26.73 22.92,26.73 24,27.81 24,31.56 25.83,31.56 27.44,33.17 ; 46.32,64.35 40.98,64.35 40.26,63.63 ; C42.1 20.6,40.3 20.6,40.39 ; C42.1 C40.1 ; U3.1 32.64,63.88 33.02,64.26 39.62,64.26 40.26,63.63 ; 36.07,26.67 41.91,26.67 43.56,25.02 U24.8 v1(48.13,25.02) 52.45,29.34 R32.2 ; 36.07,26.67 36.07,23.24 38.93,20.38 C15.1 C16.1 38.93,16 38.88,16 38.88,15.05 ; 36.07,26.67 31.02,31.71 U6.5 31.02,34.04 34.83,37.85 34.83,40.44 29.46,45.81 C53.2 ; 40.26,63.63 U3.7 ; 27.44,33.17 R2.2 R19.2 ; 27.44,33.17 31.02,33.17 ; U14.1 v1(21.55,51.05) ; 54.95,48.56 55.76,48.56 56.64,49.44 56.64,55.63 51.18,61.09 47.24,61.09 46.31,62.02 46.31,64.35 ; v1(27.14,49.4) 27.97,48.58 C53.2 ; U9.2 U9.4 ; C53.2 30.88,48.58 31.58,49.28 38.48,49.28 39.2,48.55 U11.14 ; 32.6,62.34 32.6,62.3 29.46,62.3 ; U13.2 C5.2 C4.2 v1(104.64,8.76) 105.8,9.91 R4.1 C66.2
  Bottom Layer w0.254: v1(2.29,48.64) v1(2.29,35.94)
  Bottom Layer w0.5: 104.14,30.39 109.05,30.39 117.86,21.59 117.86,14.35 112.26,8.76 v1(104.64,8.76) ; v1(27.14,49.4) 25.49,51.05 v1(21.55,51.05) ; H8.4 H8.2 H8.1 ; v1(59.9,22.35) 57.24,25.02 v1(48.13,25.02) ; RJ1.9 11.05,11.94 11.68,11.3 21.21,11.3 RJ1.11 ; 15.27,26.73 15.27,16.79 11.05,12.57 ; v1(59.44,43.94) 77.47,43.94 88.27,32.89 101.6,32.93
3V3_CAN: length 114.2
  Top Layer w0.254: v1(19.43,58.8) C61.2 15.94,59.62 13.72,61.85 12.94,61.85
  Top Layer w0.5: v1(43.69,79.5) C44.2 44.73,77.41 45.18,77.86 U15.5 ; 58.93,83.55 60.22,83.55 60.96,82.8 C50.2 ; 32.64,72.64 32.64,75.7 ; U14.8 21.53,58.8 v1(19.43,58.8) ; 46.32,69.76 46.23,69.85 v1(45.05,69.85) ; C51.2 40.51,82.68 39.64,83.55 38.35,83.55 ; C43.2 30.61,73.15 31.13,72.63 U3.16 32.64,70.99 33.15,70.48 39.62,70.48 40.26,71.12 U3.10 ; U4.5 v1(58.93,81.53) ; U1.5 v1(38.35,81.41)
  Bottom Layer w0.5: v1(45.04,69.85) 41.87,73.03 35.31,73.03 v1(32.64,75.69) ; v1(32.64,75.69) 32.64,78.65 35.39,81.41 v1(38.35,81.41) 41.78,81.41 v1(43.69,79.5) 45.72,81.53 v1(58.93,81.53) ; v1(32.64,75.69) 32.47,75.69 25.36,68.58 25.36,64.73 v1(19.43,58.8)
5V: length 266.3
  Top Layer w0.5: 38.47,34.92 38.47,34.03 37.61,33.17 U6.8 ; 66.67,56.9 69.6,53.97 69.6,44.2 65.79,40.39 65.79,33.91 64.14,32.26 51.08,32.26 45.04,38.29 40.96,38.29 39.62,36.96 38.47,36.96 ; 66.67,56.9 PW1.1 ; 66.67,56.9 70.7,60.92 70.7,67.94 H6.2 81.87,71.37 ; 66.67,56.9 64.09,56.9 ; C45.2 58.42,56.9 PW1.1 ; PW1.1 61.17,55.03 62.98,53.23 62.98,51.36 ; 92.44,66.17 96.01,66.17 103.5,73.65 RL10.2 103.5,76.72 102.36,77.85 ; v1(117.35,33.78) LED2.1 ; R20.2 R21.2 ; RLY1.1 103.54,79.03 102.36,77.85 ; 102.36,77.85 D1.1
  Top Layer w0.54: RL4.1 73.5,62.07 72.35,60.92 70.7,60.92
  Bottom Layer w0.5: 77.85,69.72 76.2,71.37 H6.2 ; 77.85,69.72 79.48,71.37 96.14,71.37 103.54,78.77 RLY1.1 ; 77.85,69.72 77.85,61.64 73.15,56.9 ; v1(117.35,33.78) 115.32,35.81 89.28,35.81 78.99,46.1 78.99,51.05 73.15,56.9 ; 73.15,56.9 PW1.1
5V_CAN: length 114.3
  Top Layer w0.254: 17.52,85.22 17.58,85.28 17.58,87.76
  Top Layer w0.5: 46.7,77.22 45.75,76.27 45.75,75.56 ; 46.7,77.22 46.7,78.49 48.28,80.07 C49.2 57.09,80.07 57.66,79.5 ; 46.7,77.22 47.65,76.27 U15.3 ; 57.66,79.5 57.74,79.42 59.47,79.42 60.29,78.61 61.68,78.61 62.44,79.38 62.44,83.44 60.79,85.09 RELAY_CAN1.1 ; 57.66,79.5 57.66,74.46 56.96,73.77 C46.2 56.96,69.64 56.92,69.6 PW1.6 ; 37.08,78 37.08,79.46 36.47,80.07 C52.2 28.6,80.07 25.24,83.43 25.24,84.58 22.1,84.58 18.92,87.76 17.58,87.76 17.58,89.2 19.06,90.69 RELAY_T.1 21.94,90.69 22.82,91.57 D8.1 ; D9.1 45.04,90.03 43.77,88.77 42.38,88.77 40.74,87.13 RELAY_CAN0.1 ; 41.74,82.8 43.51,84.58 45.81,84.58 ; RL1.1 45.82,82.54 48.28,80.07 ; 37.04,79.5 38.82,79.5 39.71,78.61 41.11,78.61 41.74,79.25 41.74,82.8 40.22,84.33 40.22,87.13
5V_USB: length 49.3
  Top Layer w0.5: Q1.2 v1(75.89,81.92) ; v1(71.63,58.8) 71.63,43.43 68.07,39.88 D6.1
  Bottom Layer w0.5: v1(75.89,81.92) 71.63,77.66 v1(71.63,58.8)
GND:
  vias: v1(1.27,62.23) v1(1.27,59.69) v1(1.27,57.15) v1(2.54,63.5) v1(2.54,60.96) v1(2.54,58.42) v1(2.54,55.88) v1(3.81,62.23) v1(3.81,59.69) v1(3.81,57.15) v1(5.08,63.5) v1(5.08,60.96) v1(6.35,62.23) v1(6.35,59.69) v1(7.62,63.5) v1(7.62,60.96) v1(8.89,62.23) v1(8.89,59.69) v1(16.38,42.55) v1(17.65,50.29) v1(25.4,41.78) v1(25.4,39.24) v1(26.67,40.51) v1(27.94,41.78) v1(27.94,39.24) v1(35.81,40.64) v1(39.88,44.83) v1(40.64,58.42) v1(43.18,62.23) v1(43.18,52.2) v1(56.77,18.16) v1(61.34,20.83) v1(80.64,80.01)
SGND:
  vias: v1(20.57,61.85)
VBUS: length 24.4
  Top Layer w0.5: D6.2 68.07,32.39 65.02,29.34 ; 65.02,29.34 65.02,21.39 62.94,19.3 62.94,14.97 60.94,12.97 ; 65.02,29.34 R3.1
A_LED: length 74.1
  Top Layer w0.254: v1(16.76,54.86) 17.27,54.36 R40.1
  Bottom Layer w0.254: RJ1.12 22.36,10.16 10.8,10.16 3.94,17.02 3.94,49.4 6.35,51.82 13.72,51.82 v1(16.76,54.86)
AC_L: length 21.7
  Top Layer w1.5: 123.74,107.31 117.56,107.31 U2.2
  Bottom Layer w1.5: U2.2 117.56,107.31 123.74,107.31
AC_N: length 82.3
  Top Layer w1.5: 112.86,77.72 112.86,81.31 R54.1 109.27,110.61 U2.1 ; 114.07,71.44 112.85,72.66 112.85,77.72
  Bottom Layer w1.5: 114.07,71.44 112.85,72.66 112.85,77.72 ; 112.86,77.72 112.86,81.31 R54.1 109.27,110.61 U2.1
C33_1: length 2
  Top Layer w0.254: C33.1 R33.2
C34_1: length 2
  Top Layer w0.254: C34.1 R12.2
C35_1: length 2.5
  Top Layer w0.254: 26.67,18.03 R15.2
C36_1: length 2.6
  Top Layer w0.254: C36.1 26.72,23.49 R16.2
C37_2: length 33.9
  Top Layer w0.254: R12.1 R33.1 10.91,20.06 13.72,22.86 22.48,22.86 26.16,26.54 C37.2 27.62,25.47 28.19,24.89 29.97,24.89 30.48,24.38 30.48,22.48 29.96,21.98 R16.1 R15.1
CAN0_1: length 22.8
  Bottom Layer w1: 64.52,109.85 61.85,112.52 46.61,112.52 43.94,109.85
CAN0_2: length 20.2
  Top Layer w0.254: CAN0.2 38.95,103.92 42.12,100.75 42.12,93.1 41.55,92.52 40.22,92.53
CAN0_3: length 20.4
  Top Layer w0.254: RELAY_CAN0.6 31.16,92.53 30.57,93.13 30.57,100.62 33.95,104 33.95,109.85
CAN0_4: length 22.8
  Bottom Layer w1: 28.96,109.85 31.62,107.19 46.86,107.19 49.53,109.85
CAN1_2: length 20.2
  Top Layer w0.254: RELAY_CAN1.3 62.12,92.52 62.7,93.1 62.7,100.62 59.52,103.79 59.52,109.85
CAN1_3: length 20.4
  Top Layer w0.254: RELAY_CAN1.6 51.73,92.53 51.14,93.13 51.14,100.62 54.52,104 CAN1.3
CHIP_PU: length 41.2
  Top Layer w0.254: EN.3 EN.4 119.13,14.48 118.41,13.76 Q7.3 ; 115.7,13.76 110.74,13.76 ; U13.3 104.39,10.03 105.78,11.42 R4.2 C17.2
CS_CAN0: length 63
  Top Layer w0.254: v1(75.82,47.12) 78.07,44.87 U13.24 ; 37.93,46.54 v1(37.93,48.39)
  Bottom Layer w0.254: v1(37.93,48.39) 39.2,47.12 v1(75.82,47.12)
CS_CAN1: length 47.1
  Top Layer w0.254: v1(75.82,45.85) 76.8,44.87 U13.25 ; U12.13 v1(51.78,44.87)
  Bottom Layer w0.254: v1(51.78,44.87) 52.76,45.85 v1(75.82,45.85)
CS_SD: length 68
  Top Layer w0.254: CARD.2 v1(41.08,13.34) ; v1(82.55,18.92) 85.68,22.06 85.68,25.28
  Bottom Layer w0.254: v1(82.55,18.92) 74.25,18.92 64.73,28.45 44.32,28.45 41.08,25.2 41.08,13.34
CS_W5500: length 81
  Top Layer w0.254: 31.58,44.96 34.88,41.66 47.62,41.66 v1(51.69,37.59) ; v1(14.44,45.59) 12.93,47.11 U7.32 ; v1(75.69,21.46) 75.69,21.46 U13.29
  Bottom Layer w0.254: v1(51.69,37.59) 65.62,37.59 70.32,32.89 70.32,25.69 74.55,21.46 v1(75.69,21.46) ; v1(31.58,44.96) 15.07,44.96 v1(14.44,45.59)
DTR: length 79.4
  Top Layer w0.254: v1(115.7,17.78) 116.65,18.73 116.65,19.57 117.2,19.57 R22.2 ; v1(52.28,22.48) 53.07,23.26 UAT_TO_USB.28
  Bottom Layer w0.254: v1(115.7,17.78) 115.7,15.11 111,10.41 71.5,10.41 64.01,17.91 59.18,17.91 54.61,22.48 v1(52.28,22.48)
ESP_IO_6: length 19.8
  Top Layer w0.254: 104.14,20.23 105.66,18.71 105.66,16.64 102.86,13.84 U13.6
ESP_IO_7: length 12.5
  Top Layer w0.254: 101.6,20.23 98.47,20.23 93.34,15.11 U13.7
ESP_IO_8: length 31.2
  Top Layer w0.254: U13.35 72.1,13.84 67.31,18.63 v1(67.31,29.72)
  Bottom Layer w0.254: ENCODER.3 60.79,31.88 65.15,31.88 v1(67.31,29.72)
ESP_IO_9: length 28.3
  Top Layer w0.254: U13.34 72.23,15.11 68.2,19.14 v1(68.2,28.7)
  Bottom Layer w0.254: ENCODER.2 60.29,34.8 62.19,32.89 65.53,32.89 68.2,30.23 v1(68.2,28.7)
ESP_IO_10: length 25.2
  Top Layer w0.254: v1(69.09,27.56) 69.09,19.56 72.27,16.38 U13.33
  Bottom Layer w0.254: ENCODER.1 65.02,34.92 69.09,30.86 v1(69.09,27.56)
ESP_IO_11: length 69.1
  Top Layer w0.254: U13.32 72.48,17.65 70.74,19.39 70.74,40.26 73.28,42.8 v1(73.28,51.82) ; 47.58,64.35 v1(47.58,62.61)
  Bottom Layer w0.254: v1(73.28,51.82) 71.12,53.97 56.22,53.97 v1(47.58,62.61)
ESP_IO_12: length 68.1
  Top Layer w0.254: 48.86,64.35 v1(48.86,62.61) ; v1(74.55,52.96) 74.55,42.42 71.84,39.71 71.84,19.56 72.48,18.92 U13.31
  Bottom Layer w0.254: v1(48.86,62.61) 56.35,55.12 72.39,55.12 v1(74.55,52.96)
ESP_IO_15: length 15.5
  Top Layer w0.254: 104.14,22.77 102.83,21.46 98.3,21.46 93.21,16.38 U13.8
ESP_IO_16: length 12.5
  Top Layer w0.254: U13.9 93.09,17.65 98.21,22.77 101.6,22.77
ESP_IO_17: length 15.5
  Top Layer w0.254: 104.14,25.31 102.96,24.13 98.17,24.13 92.96,18.92 U13.10
ESP_IO_18: length 12.5
  Top Layer w0.254: U13.11 92.96,20.19 98.08,25.31 101.6,25.31
GPIO_0: length 68.9
  Top Layer w0.254: 115.7,21.8 120.48,21.8 122.61,23.93 122.61,25.91 ; U13.27 73.79,24.03 v1(73.79,26.92) ; Q8.3 v1(113.03,21.8) ; BOOT.3 BOOT.4
  Bottom Layer w0.254: v1(113.03,21.8) 106.4,15.15 91.06,15.15 79.29,26.92 v1(73.79,26.92)
H1_2: length 7.6
  Top Layer w0.254: R34.2 v1(32.6,100.62)
  Bottom Layer w0.254: v1(32.6,100.62) 31.84,100.62 29.17,97.95 27.61,97.95 H1.2
HGND:
  vias: v1(11.56,17.65) v1(17.53,12.57) v1(18.67,17.27) v1(25.02,23.5)
INT_CAN0: length 69.7
  Top Layer w0.254: v1(75.82,48.51) 79.33,45 U13.23 ; v1(41.11,51.56) R36.1 35.78,50.06 35.39,50.45 U11.4
  Bottom Layer w0.254: v1(41.11,51.56) 44.16,48.51 v1(75.82,48.51)
INT_CAN1: length 57.2
  Top Layer w0.254: v1(54.95,51.56) R37.1 49.63,50.06 49.24,50.45 U12.4 ; v1(75.82,49.91) 80.61,45.12 U13.22
  Bottom Layer w0.254: v1(75.82,49.91) 56.6,49.91 v1(54.95,51.56)
INT_W5500: length 91
  Top Layer w0.254: U7.36 v1(9.4,48.57) 8.32,48.57 6.6,50.29 R26.2 ; v1(53.09,38.99) 49.66,42.42 v1(35.27,42.42) ; v1(75.69,22.73) 75.69,22.73 U13.28
  Bottom Layer w0.254: v1(9.4,48.57) 9.4,46.3 12.14,43.56 34.12,43.56 v1(35.27,42.42) ; v1(53.09,38.99) 65.75,38.99 71.33,33.4 71.33,26.08 74.68,22.73 v1(75.69,22.73)
L_LED: length 66.5
  Top Layer w0.254: R17.1 v1(19.3,55.12)
  Bottom Layer w0.254: 13.34,12.57 16.76,15.99 16.76,27.05 15.62,28.19 6.6,28.19 5.29,29.5 5.29,49.02 6.69,50.42 14.61,50.42 v1(19.3,55.12)
LM_5V_7: length 11.3
  Top Layer w0.75: LM_5V.7 78.95,106.76 P2.2
LM_5V_8: length 1.9
  Top Layer w0.254: 71.97,98.67 73.91,98.67
MISO: length 143.8
  Top Layer w0.254: U12.12 v1(50.51,44.87) 50.51,44.11 v1(54.36,40.26) ; v1(12.41,45.59) 11.93,46.07 U7.34 ; v1(36.7,13.34) 36.19,13.34 35.58,13.95 35.58,15.05 ; U13.21 81.92,25.32 v1(81.92,26.92) 81.92,28.32 83.99,30.39 101.6,30.39 ; U11.12 v1(36.66,44.87)
  Bottom Layer w0.254: v1(12.41,45.59) 13.93,47.12 34.41,47.12 v1(36.66,44.87) 36.7,44.87 37.55,45.72 49.65,45.72 v1(50.51,44.87) ; v1(54.36,40.26) 65.87,40.26 72.1,34.04 74.8,34.04 v1(81.92,26.92) ; v1(36.7,13.34) 36.66,44.87
MOSI: length 142.5
  Top Layer w0.254: U12.11 v1(49.24,44.87) ; U11.11 v1(35.39,44.87) 35.39,44.83 36.16,44.07 v1(43.77,44.07) ; CARD.3 v1(39.98,13.34) ; H8.5 85.34,27.85 v1(84.42,26.92) U13.19 ; U7.35 v1(11.43,45.63)
  Bottom Layer w0.254: 39.98,13.34 39.98,41.88 42.16,44.07 43.77,44.07 ; v1(43.77,44.07) 48.44,44.07 v1(49.24,44.87) 52.07,42.04 66.76,42.04 72.98,35.81 75.52,35.81 84.41,26.92 ; v1(35.39,44.87) 34.72,44.2 12.86,44.2 v1(11.43,45.63)
NEO_IN: length 36.3
  Top Layer w0.254: LED2.4 117.35,25.15 116.08,23.88 111.63,23.88 108.2,20.45 108.2,15.62 103.88,11.3 U13.4
PT_PW: length 47.9
  Top Layer w0.254: H4.2 15.2,66 14.73,65.53 14.73,63.37 16.76,61.35 17.54,61.35 ; RELAY_T.5 v1(12.02,100.2)
  Bottom Layer w0.254: H4.2 13.29,69.34 12.19,69.34 10.63,70.91 10.63,76.07 12.15,77.6 12.53,77.6 14.44,79.5 14.44,82.3 12.02,84.71 v1(12.02,100.2)
PT_PWA: length 11.3
  Top Layer w0.254: R39.1 5.06,70.25 6.06,71.25 7.58,71.25
  Bottom Layer w0.254: 7.58,71.25 8.85,71.25 H4.1
PT_PWB: length 12.6
  Top Layer w0.254: R49.2 26.67,71.25 ; R6.1 R5.1 ; 22.82,71.25 21.55,71.25 H4.3
PT_RL: length 13.6
  Top Layer w0.254: U25.8 18.8,61.85
  Bottom Layer w0.254: H3.2 17.11,69.34 18.25,69.34 19.77,67.82 19.77,62.83 v1(18.8,61.85)
PT_RLA: length 14
  Top Layer w0.254: U17.1 R39.2 4.77,72.25 6.27,73.75 R45.1 10.16,73.75 H3.1
PT_RLB: length 20.1
  Top Layer w0.254: 26.67,67.7 27.42,67.7 27.81,68.09 27.81,72.39 27.44,72.76 26.67,72.76 ; R46.2 R6.2 24.99,72.76 24,73.75 R49.1 20.24,73.75 H3.3
R8_1: length 2
  Top Layer w0.254: R9.1 R8.1
R10_1: length 4
  Top Layer w0.254: R10.1 R11.1 18.68,32.63 18.8,32.51 19.71,32.51
R13_1: length 3.2
  Top Layer w0.254: R13.1 92.44,71.85 92.44,68.71
R14_2: length 9.3
  Top Layer w0.254: R14.2 R13.2 93.97,73.41 93.47,73.91 91.19,73.91 90.62,74.48 Q2.1
R22_1: length 2
  Top Layer w0.254: 116.65,15.96 117.17,15.96 R22.1
R29_1: length 2.1
  Top Layer w0.254: R29.1 114.07,19.57 114.75,19.57
R35_2: length 7.6
  Top Layer w0.254: R35.2 v1(53.17,100.62)
  Bottom Layer w0.254: H2.2 49.84,98.04 52.41,100.62 v1(53.17,100.62)
R43_2: length 8.1
  Top Layer w0.254: 6.32,85.22 6.32,87.5 5.08,88.74 5.08,91.31 5.39,91.63 Q6.1
R46_1: length 9
  Top Layer w0.254: R46.1 21.05,77.08 20.28,77.85 R47.2
R51_2: length 51.8
  Top Layer w0.254: 47.34,73.03 43.82,73.03 41.74,75.1 41.74,77.34 42.89,78.49 42.89,81.28 v1(43.65,82.04) ; Q3.1 24.15,88.83 23.21,87.89 23.21,87.12 ; v1(23.2,85.72) 23.2,87.11 R52.2 ; v1(43.65,85.72) 44.66,85.72 45.16,86.22 R51.2 45.16,87.88 46.12,88.83 Q4.1
  Bottom Layer w0.254: v1(43.65,82.04) v1(43.65,85.72) v1(23.2,85.72)
R54_2: length 51.5
  Top Layer w1.5: 122.07,71.45 122.86,72.23 C14.2 122.81,78.03 F1.2 122.81,87.12 117.54,92.39 R54.2
  Bottom Layer w1.5: 122.07,71.45 122.86,72.24 C14.2 122.81,78.03 F1.2 122.81,87.12 117.54,92.39 R54.2
R55_2: length 2.7
  Top Layer w0.5: R55.2 77.79,82.62 77.79,80.02
RELAY_CAN0_2: length 21.8
  Top Layer w0.254: RELAY_CAN1.2 v1(58.89,90.33) ; RELAY_CAN0.2 v1(42.12,90.33)
  Bottom Layer w0.254: v1(42.12,90.33) 43.56,88.9 57.46,88.9 v1(58.89,90.33)
RELAY_CAN0_4: length 27.3
  Top Layer w0.254: RELAY_CAN0.4 38.85,94.73 v1(37.08,92.96) U1.6 ; D10.2 37.36,96.15 38.78,94.73
  Bottom Layer w0.254: H1.3 34.54,95.5 v1(37.08,92.96)
RELAY_CAN0_5: length 19.7
  Top Layer w0.254: 34.04,94.73 35.46,96.15 35.46,97.55 ; RELAY_CAN0.5 34.04,94.73 35.81,92.96 35.81,83.55 ; 32.6,94.73 R34.1
RELAY_CAN0_7: length 21.5
  Top Layer w0.254: RELAY_CAN1.7 v1(51.27,90.33) ; 32.6,90.33 v1(34.5,90.33)
  Bottom Layer w0.254: v1(34.5,90.33) 35.61,91.44 50.16,91.44 v1(51.27,90.33)
RELAY_CAN0_8: length 11.9
  Top Layer w0.254: LED5.1 31.59,84.59 32.6,85.6 32.6,87.13
  Top Layer w0.5: 32.6,87.13 31.19,87.13 30.44,87.88 Q3.3 29.68,90.81 28.92,91.57 D8.2
RELAY_CAN1_4: length 27.5
  Top Layer w0.254: 59.35,94.73 57.93,96.15 D11.2 ; 57.66,83.37 v1(57.66,92.96) 59.43,94.73 RELAY_CAN1.4
  Bottom Layer w0.254: v1(57.66,92.96) 55.12,95.5 H2.3
RELAY_CAN1_5: length 19.7
  Top Layer w0.254: D11.1 56.03,96.15 54.62,94.73 ; 54.61,94.73 56.39,92.96 56.39,83.55 ; 54.61,94.73 RELAY_CAN1.5 R35.1
RELAY_CAN1_8: length 12.2
  Top Layer w0.254: RELAY_CAN1.8 53.17,85.09 52.67,84.59 51.56,84.59
  Top Layer w0.5: D9.2 49.49,91.57 50.25,90.81 Q4.3 51.01,87.88 51.77,87.13 RELAY_CAN1.8
RELAY_T_8: length 12.4
  Top Layer w0.254: 14.17,87.76 12.66,87.76 11.9,87 LED4.1
  Top Layer w0.5: 8.69,90.68 12.03,90.69 12.03,88.39 12.66,87.76 14.17,87.76
RJ1_1: length 15.3
  Top Layer w0.254: 21.48,5.98 22.35,6.85 22.35,8.13 21.08,9.4 21.08,17.15 22.44,18.5 T1.16
RJ1_2: length 12.3
  Top Layer w0.254: T1.14 19.9,17.69 20.46,17.13 20.46,7.75
RJ1_3: length 23.2
  Top Layer w0.254: v2(19.43,9.27) 18.67,10.03 18.67,15.24 16.09,17.82 T1.11
  Bottom Layer w0.254: 19.44,5.97 20.85,4.57 22.1,4.57 22.99,5.46 22.99,8.25 21.97,9.27 v2(19.43,9.27)
RJ1_4: length 18.5
  Top Layer w0.254: v1(6.6,12.57) C34.2 ; 18.41,7.75 17.39,5.97
  Bottom Layer w0.254: v1(6.6,12.57) 10.03,9.14 17.03,9.14 18.42,7.75
RJ1_6: length 13.2
  Top Layer w0.254: RJ1.6 16.34,15.03 13.55,17.82 T1.9
RJ1_7: length 15.3
  Top Layer w0.254: 14.35,7.75 15.37,5.97 ; C33.2 13.65,15.18 15.24,13.59 15.24,10.54 14.34,9.64 14.34,7.75
RL1_2: length 2.6
  Top Layer w0.254: 47.32,84.58 49.96,84.58
RL2_2: length 2.6
  Top Layer w0.254: LED5.2 26.75,84.58 26.75,84.58
RL3_2: length 2.5
  Top Layer w0.254: LED4.2 13.5,85.22 RL3.2
RL4_2: length 3.5
  Top Layer w0.254: 78.54,63.5 78.53,63.5 RL4.2
RL10_1: length 3.7
  Top Layer w0.254: LED1.2 101.99,74.55
RL_CAN: length 3.3
  Top Layer w0.254: 48.85,73.03 48.86,69.76
RL_IN1: length 68
  Top Layer w0.254: U13.5 103.37,12.57 106.93,16.13 106.93,41.91 96.78,52.06 R59.1
RL_T_OUT: length 28.8
  Top Layer w0.254: 19.65,98.29 v1(19.65,100.2)
  Bottom Layer w0.254: v1(19.65,100.2) 16.6,97.15 16.6,76.58 H5.2
RL_T_OUTA: length 4.8
  Top Layer w0.254: R38.1 H5.1
RL_T_OUTB: length 5
  Top Layer w0.254: H5.3 R47.1
RL_TEMP: length 52.8
  Top Layer w0.254: U18.7 47.58,70.99 47.08,71.5 44.79,71.5 42.38,69.09 30.99,69.09 28.83,71.25 28.83,77.94 23.45,83.31 9.73,83.31 R44.1
RLY1_2: length 29.3
  Top Layer w2.5: U5.3 100.38,106.63 103.54,103.47 RLY1.2
  Bottom Layer w2.5: 100.38,110.62 100.38,106.63 103.54,103.47 RLY1.2
RLY1_3: length 27.7
  Top Layer w2.5: RLY1.3 91.54,101.63 90.38,102.79 U5.1
  Bottom Layer w2.5: RLY1.3 91.54,101.63 90.38,102.79 U5.1
RLY1_4: length 15.2
  Top Layer w0.254: D1.2 95.84,75.45 LED1.1
  Top Layer w0.5: RLY1.4 91.57,85.04 Q2.3 ; Q2.3 91.61,77.85 D1.2 ; Q2.3 91.57,77.82
RLY1_5: length 56.9
  Top Layer w2.5: U5.2 95.38,104.27 97.54,102.11 RLY1.5
  Bottom Layer w2.5: U5.2 95.38,104.27 97.54,102.11 RLY1.5
RST_W5500: length 90.3
  Top Layer w0.254: U13.30 73.77,20.19 v1(75.69,20.19) ; v1(51.31,30.61) 48.64,27.94 36.7,27.94 v1(34.16,30.48) ; R7.2 v1(6.86,48.64) 8.43,47.07 U7.37
  Bottom Layer w0.254: v1(34.16,30.48) 31.75,32.89 24.6,32.89 14.69,42.8 11.64,42.8 6.86,47.58 v1(6.86,48.64) ; v1(51.31,30.61) 64.01,30.61 74.42,20.19 v1(75.69,20.19)
RTS: length 76.1
  Top Layer w0.254: v1(51.18,26.03) 51.95,25.26 UAT_TO_USB.24 ; Q7.2 114.1,15.96 R29.2 ; v1(113.03,14.99) 113.07,14.99 114.07,15.99
  Bottom Layer w0.254: 50.8,26.03 63.5,26.03 77.47,12.06 110.11,12.06 v1(113.03,14.99)
RX0: length 28.1
  Top Layer w0.254: v1(72.01,12.57) 73.76,12.57 U13.36 ; UAT_TO_USB.26 52.84,24.26 v1(52.32,23.75)
  Bottom Layer w0.254: v1(52.32,23.75) 55.75,23.75 59.82,19.69 64.9,19.69 v1(72.01,12.57)
RX_CAN0: length 10.5
  Top Layer w0.254: 37.93,52.07 37.93,53.55 38.23,53.85 38.23,59.94 37.72,60.45 U3.5
RX_CAN1: length 22
  Top Layer w0.254: U3.6 38.99,60.71 39.88,59.82 50.63,59.82 52.07,58.38 52.07,54.27 51.78,53.97 U12.2
RX_CAN_0B: length 6.4
  Top Layer w0.254: 38.35,78 38.35,76.29 38.95,75.69 38.95,71.84
RX_CAN_1B: length 25.8
  Top Layer w0.254: U4.4 v1(58.93,76.33) ; U3.12 v1(37.72,75.06)
  Bottom Layer w0.254: v1(58.93,76.33) 57.66,75.06 v1(37.72,75.06)
RXN: length 19.9
  Top Layer w0.254: U7.5 12.93,41.77 v1(12.91,41.78) ; C10.2 v1(7.24,30.61)
  Bottom Layer w0.254: v1(12.91,41.78) 9.02,41.78 7.87,40.64 7.87,35.31 5.97,33.4 5.97,31.88 v1(7.24,30.61)
RXP: length 17.2
  Top Layer w0.254: C9.2 v1(7.24,32.64) ; v1(14.06,41.78) 13.43,41.15 U7.6
  Bottom Layer w0.254: v1(7.24,32.64) 9.1,34.5 9.1,40.13 9.74,40.77 13.04,40.77 v1(14.06,41.78)
SCK: length 153.4
  Top Layer w0.254: U7.33 12.43,46.59 v1(13.42,45.59) ; U12.10 v1(47.97,44.87) 46.28,43.18 35.77,43.18 34.12,44.83 v1(34.12,44.87) U11.10 ; U13.20 v1(83.14,26.92) 83.14,27.77 84.45,29.08 102.91,29.08 104.14,27.85 ; CARD.5 37.78,13.91 38.35,13.34 v1(38.86,13.34)
  Bottom Layer w0.254: v1(38.86,13.34) 38.86,42.33 41.36,44.83 47.93,44.83 47.97,44.86 ; 46.31,43.18 49.36,43.18 51.39,41.15 66.38,41.15 72.6,34.92 75.14,34.92 v1(83.14,26.92) ; v1(34.12,44.87) 32.63,46.36 14.18,46.36 v1(13.42,45.59)
  vias: v1(46.32,43.18)
SCL: length 18
  Top Layer w0.254: R21.1 34.07,34.92 33.56,34.42 U6.7 33.56,32.48 34.29,31.75 41.02,31.75 42.57,33.29 DISPLAY.3
SCL_CAN: length 9.4
  Top Layer w0.254: U25.10 22.07,62.85 24.09,60.83 U14.6
SCL_LV: length 161.9
  Top Layer w0.254: v1(72.01,7.49) 72.01,8 72.77,8.76 U13.39 ; U24.6 44.92,22.48 44.16,21.72 44.16,14.1 39.08,9.02 v1(35.01,9.02) ; U14.3 24.09,49.91 v1(31.08,42.93) 33.56,40.44 U6.2 33.56,37.54 30.95,34.92 R2.1 ; U21.4 103.54,5.29 103.51,5.33 103.38,5.33
  Bottom Layer w0.254: v1(31.08,42.93) 30.19,42.04 30.19,41.28 35.01,36.45 v1(35.01,9.02) 35.01,8.04 37.08,5.97 48.01,5.97 50.04,3.94 68.45,3.94 v1(72.01,7.49) 101.35,7.49 103.51,5.33
  vias: v1(103.51,5.29)
SDA: length 21.1
  Top Layer w0.254: 32.29,33.17 32.29,34.36 34.89,36.96 R20.1 ; U6.6 32.29,32.48 33.53,31.24 41.02,31.24 41.47,30.79 DISPLAY.4
SDA_CAN: length 12.3
  Top Layer w0.254: U14.7 22.82,59.98 22.61,60.2 16.38,60.2 13.73,62.85 12.94,62.85
SDA_LV: length 153.7
  Top Layer w0.254: R19.1 31.78,36.96 32.29,37.47 32.29,40.44 v1(31.08,41.66) 22.82,49.91 U14.2 ; v1(103.51,6.99) 105.92,6.99 106.99,5.91 U21.3 ; v1(37.68,7.75) 39.08,7.75 45.05,13.72 45.05,19.3 46.23,20.49 U24.5 ; v1(71.97,9.4) 72.6,10.03 U13.38
  Bottom Layer w0.254: 31.07,41.66 35.81,36.92 35.81,9.61 37.68,7.75 49.53,7.75 51.82,5.46 68.03,5.46 v1(71.97,9.4) 101.09,9.4 v1(103.51,6.99)
T1_6: length 11.7
  Top Layer w0.254: T1.6 16.09,29.63 15.75,29.97 14.86,29.97 14.61,30.23 14.61,32.26 14.22,32.64 R9.2 13.45,33.41 12.95,33.91 10.54,33.91 9.97,33.34 C9.1
T1_8: length 7.5
  Top Layer w0.254: C10.1 9.97,29.27 10.8,28.45 T1.8 13.55,29.5 13.45,29.6 R8.2
T1_10: length 13.6
  Top Layer w0.254: T1.10 14.82,21.17 15.68,22.03 26.67,22.03
T1_15: length 7.3
  Top Layer w0.254: 26.67,19.43 24.89,19.43 23.11,21.21 21.72,21.21 21.17,20.66 T1.15
T_SENSOR_1: length 16.8
  Top Layer w0.254: T_SENSOR.1 23.34,97.29 22.13,96.09 RELAY_T.3
T_SENSOR_2: length 17.4
  Top Layer w0.254: T_SENSOR.2 18.33,100.67 13.75,96.09 RELAY_T.6
T_SENSOR_3: length 18.9
  Top Layer w0.254: T_SENSOR.3 13.34,104.43 10.12,101.22 10.12,94.36 10.59,93.89 RELAY_T.7
T_SENSOR_4: length 27.6
  Top Layer w0.254: 19.65,93.89 v1(22.06,93.89)
  Bottom Layer w0.254: v1(22.06,93.89) 22.06,102.23 20.28,104.01 14.22,104.01 8.37,109.85
TX0: length 31.1
  Top Layer w0.254: U13.37 v1(72.01,11.3) ; 54.1,24.76 52.2,24.76 v1(51.18,23.75)
  Bottom Layer w0.254: v1(51.18,23.75) 51.82,23.11 55.24,23.11 59.56,18.8 64.51,18.8 v1(72.01,11.3)
TX_CAN0: length 11.8
  Top Layer w0.254: U3.3 v1(35.18,60.33) ; U11.1 v1(39.2,53.97)
  Bottom Layer w0.254: v1(39.2,53.97) 39.2,56.3 v1(35.18,60.33)
TX_CAN1: length 23
  Top Layer w0.254: U12.1 v1(53.05,53.97) ; U3.4 v1(36.45,60.33)
  Bottom Layer w0.254: v1(36.45,60.33) 42.8,53.97 v1(53.05,53.97)
TX_CAN_0B: length 5.6
  Top Layer w0.254: 34.54,78 34.54,75.14 35.18,74.51 U3.14
TX_CAN_1B: length 23.7
  Top Layer w0.254: U4.1 v1(55.12,76.33) ; U3.13 v1(36.45,75.69)
  Bottom Layer w0.254: v1(55.12,76.33) 37.08,76.33 v1(36.45,75.69)
TXN: length 21.1
  Top Layer w0.254: 10.92,40.07 10.92,38.99 v1(10.54,38.61) ; 19.9,28.45 19.9,29.46 v1(19.52,29.84) 17.03,29.84 R10.2
  Bottom Layer w0.254: v1(10.54,38.61) 11.3,37.85 13.29,37.85 19.52,31.62 v1(19.52,29.84)
TXP: length 21.6
  Top Layer w0.254: R11.2 18.91,31.12 19.32,30.72 v1(21.56,30.72) ; 22.44,28.45 22.44,29.84 21.56,30.72 ; v1(11.43,38.61) 11.43,38.61 U7.2
  Bottom Layer w0.254: 21.56,30.72 13.68,38.61 v1(11.43,38.61)
U7_10: length 4
  Top Layer w0.254: 15.43,40.07 15.43,38.41 13.93,36.92 13.93,36.7
U7_20: length 2.9
  Top Layer w0.254: U7.20 19.02,45.07 19.52,44.58 C30.2
U7_22: length 2.9
  Top Layer w0.254: C24.1 19.81,46.61 19.28,46.07 U7.22
U7_23: length 4
  Top Layer w0.254: 17.92,46.57 18.85,46.57 19.18,46.9 19.18,47.88 19.81,48.51 R25.2
U7_25: length 4.7
  Top Layer w0.254: U7.25 17.29,48.57 19.3,50.59 R17.2
U7_27: length 4.2
  Top Layer w0.254: R40.2 16.52,51.57 15.43,50.48 U7.27
U7_30: length 11.9
  Top Layer w0.254: R23.2 10.29,55.63 9.86,55.2 X4.1 10.77,54.22 10.94,54.04 12.28,54.04 13.23,54.04 13.68,53.59 13.68,50.55 13.92,50.3 13.92,48.57
U7_31: length 17.2
  Top Layer w0.254: R23.1 6.35,56.77 5.15,55.56 5.15,52.45 X4.3 7.66,51.14 8,50.8 12.66,50.8 13.43,50.03 U7.31
U7_38: length 4.4
  Top Layer w0.254: 5.2,46.99 6.22,46.99 6.64,46.57 9.43,46.57
U7_39: length 4.5
  Top Layer w0.254: 5.2,45.34 5.97,45.34 6.7,46.07 U7.39
U7_40: length 5
  Top Layer w0.254: 5.2,43.69 7.08,45.57 U7.40
U7_41: length 5.9
  Top Layer w0.254: 5.2,42.04 6.22,43.06 6.22,43.81 7.48,45.07 U7.41
U7_42: length 7.4
  Top Layer w0.254: U7.42 7.74,44.57 6.73,43.56 6.73,41.15 5.97,40.39 R42.2
U7_43: length 10.5
  Top Layer w0.254: 3.81,36.7 7.24,40.13 7.24,43.31 8.01,44.07 9.43,44.07
U7_44: length 9
  Top Layer w0.254: 5.84,36.7 5.84,37.34 7.75,39.24 7.75,43.05 8.27,43.57 9.43,43.57
U7_45: length 7.6
  Top Layer w0.254: 7.75,36.7 7.75,37.72 8.25,38.23 8.25,42.84 8.49,43.07 9.43,43.07
U8_1: length 6.9
  Top Layer w0.254: 102.41,66.17 102.41,63.93 101.22,62.74 R59.2
U11_5: length 9.5
  Top Layer w0.254: U11.5 34.12,53.55 35.69,55.12 35.69,55.88 36,56.2 C12.2 36.01,56.2 35.69,56.52 35.69,57.4 35.34,57.75 34.25,57.75
U11_6: length 6.9
  Top Layer w0.254: C1.2 30.54,56.2 30.69,56.05 X2.1 32.05,54.31 32.85,53.5 U11.6
U15_4: length 2.2
  Top Layer w0.254: C60.2 48.66,77.41 48.21,77.86 U15.4
U16_1: length 45.5
  Top Layer w1.5: U16.1 114.07,56.07 114.07,64.44
  Bottom Layer w1.5: 114.07,64.44 114.07,56.07 U16.1
U16_2: length 26.9
  Top Layer w1.5: 122.07,64.44 122.07,54.07 124.24,51.89
  Bottom Layer w1.5: U16.2 122.07,54.07 122.07,64.44
U17_2: length 9
  Top Layer w0.254: U17.2 9.34,77.33 10.12,78.11 R38.2
U25_9: length 3.5
  Top Layer w0.254: 17.54,62.35 16.77,62.35 15.94,63.18 15.94,64.77
UAT_TO_USB_8: length 8.3
  Top Layer w0.254: 61.73,26.92 C11.2 61.73,26.92 ; 61.73,26.92 R1.2 60.36,23.26 UAT_TO_USB.8 ; 61.73,26.92 R3.2
UAT_TO_USB_9: length 6.4
  Top Layer w0.254: R32.1 59.94,24.12 59.59,23.77 UAT_TO_USB.9
USB_DN: length 10
  Top Layer w0.254: UAT_TO_USB.5 56.98,21.22 57.88,20.31 D3.2 57.88,17.54 58.4,17 USB.2
USB_DP: length 13
  Top Layer w0.254: 55.57,19.3 55.57,13.84 USB.3 ; D4.2 55.57,20.31 56.48,21.21 UAT_TO_USB.4
X3_1: length 6.9
  Top Layer w0.254: U12.6 46.7,53.5 45.89,54.31 X3.1 44.53,56.05 44.38,56.2 C54.2
X3_3: length 9.2
  Top Layer w0.254: X3.3 49.06,57.75 49.53,57.28 49.53,56.64 49.98,56.2 C55.2 49.97,56.2 49.53,55.75 49.53,55.12 47.97,53.55 U12.5

## Copper pours and planes (outline as drawn; the poured copper is in the pictures)
5V_RAW on Top Layer: 75.18,84.07 75.18,88.01 74.68,88.65 70.83,88.65 70.57,88.9 70.57,90.93 69.68,91.82 69.68,93.85 70.32,94.49 73.87,94.49 74.51,93.85 80.48,93.85 80.86,94.23 80.86,96.14 81.24,96.52 81.75,96.52 82.13,96.14 82.13,87.63 86.95,82.93 86.99,63.75 91.82,58.93 92.2,58.29 92.2,57.66 91.82,56.77 90.93,56.39 90.3,56.39 89.66,56.77 84.07,62.36 84.07,81.53 82.17,83.44 75.82,83.44
GND on Top Layer: 68.45,114.3 68.45,64.01 66.17,61.72 57.28,61.72 52.2,66.93 30.23,66.93 28.07,64.64 28.07,58.17 26.29,56.26 13.59,56.26 10.67,59.18 10.67,63.25 9.4,64.52 0,64.52 0,24.64 21.59,24.51 26.03,28.83 32.26,28.83 33.53,27.56 33.53,18.67 30.99,16.13 30.99,0 72.9,0 72.9,5.97 73.41,6.48 91.57,6.48 92.08,5.97 92.08,0 129.54,0 129.54,40.51 116.84,40.64 106.68,50.8 106.68,81.28 99.31,81.41 89.66,81.41 87.88,83.19 87.88,114.3
GND on Bottom Layer: 68.45,114.3 68.45,64.01 66.17,61.72 57.28,61.72 52.2,66.93 30.23,66.93 28.07,64.64 28.07,58.17 26.29,56.26 13.59,56.26 10.67,59.18 10.67,63.25 9.4,64.52 0,64.52 0,24.64 21.59,24.51 26.03,28.83 32.26,28.83 33.53,27.56 33.53,18.67 30.99,16.13 30.99,0 72.9,0 72.9,5.97 73.41,6.48 91.57,6.48 92.08,5.97 92.08,0 130.94,0 130.81,40.51 116.84,40.64 106.68,50.8 106.68,81.28 89.66,81.41 87.88,83.19 87.88,114.3
SGND on Top Layer: 52.67,67.94 57.74,62.8 65.75,62.86 67.4,64.52 67.31,114.43 0,114.43 -0.04,65.53 9.87,65.53 11.64,63.75 11.64,59.69 14.06,57.28 25.74,57.21 27.01,58.55 27.01,65.09 29.8,67.94
